# Altium project M2RB.PrjPcb (part 1 of 2)
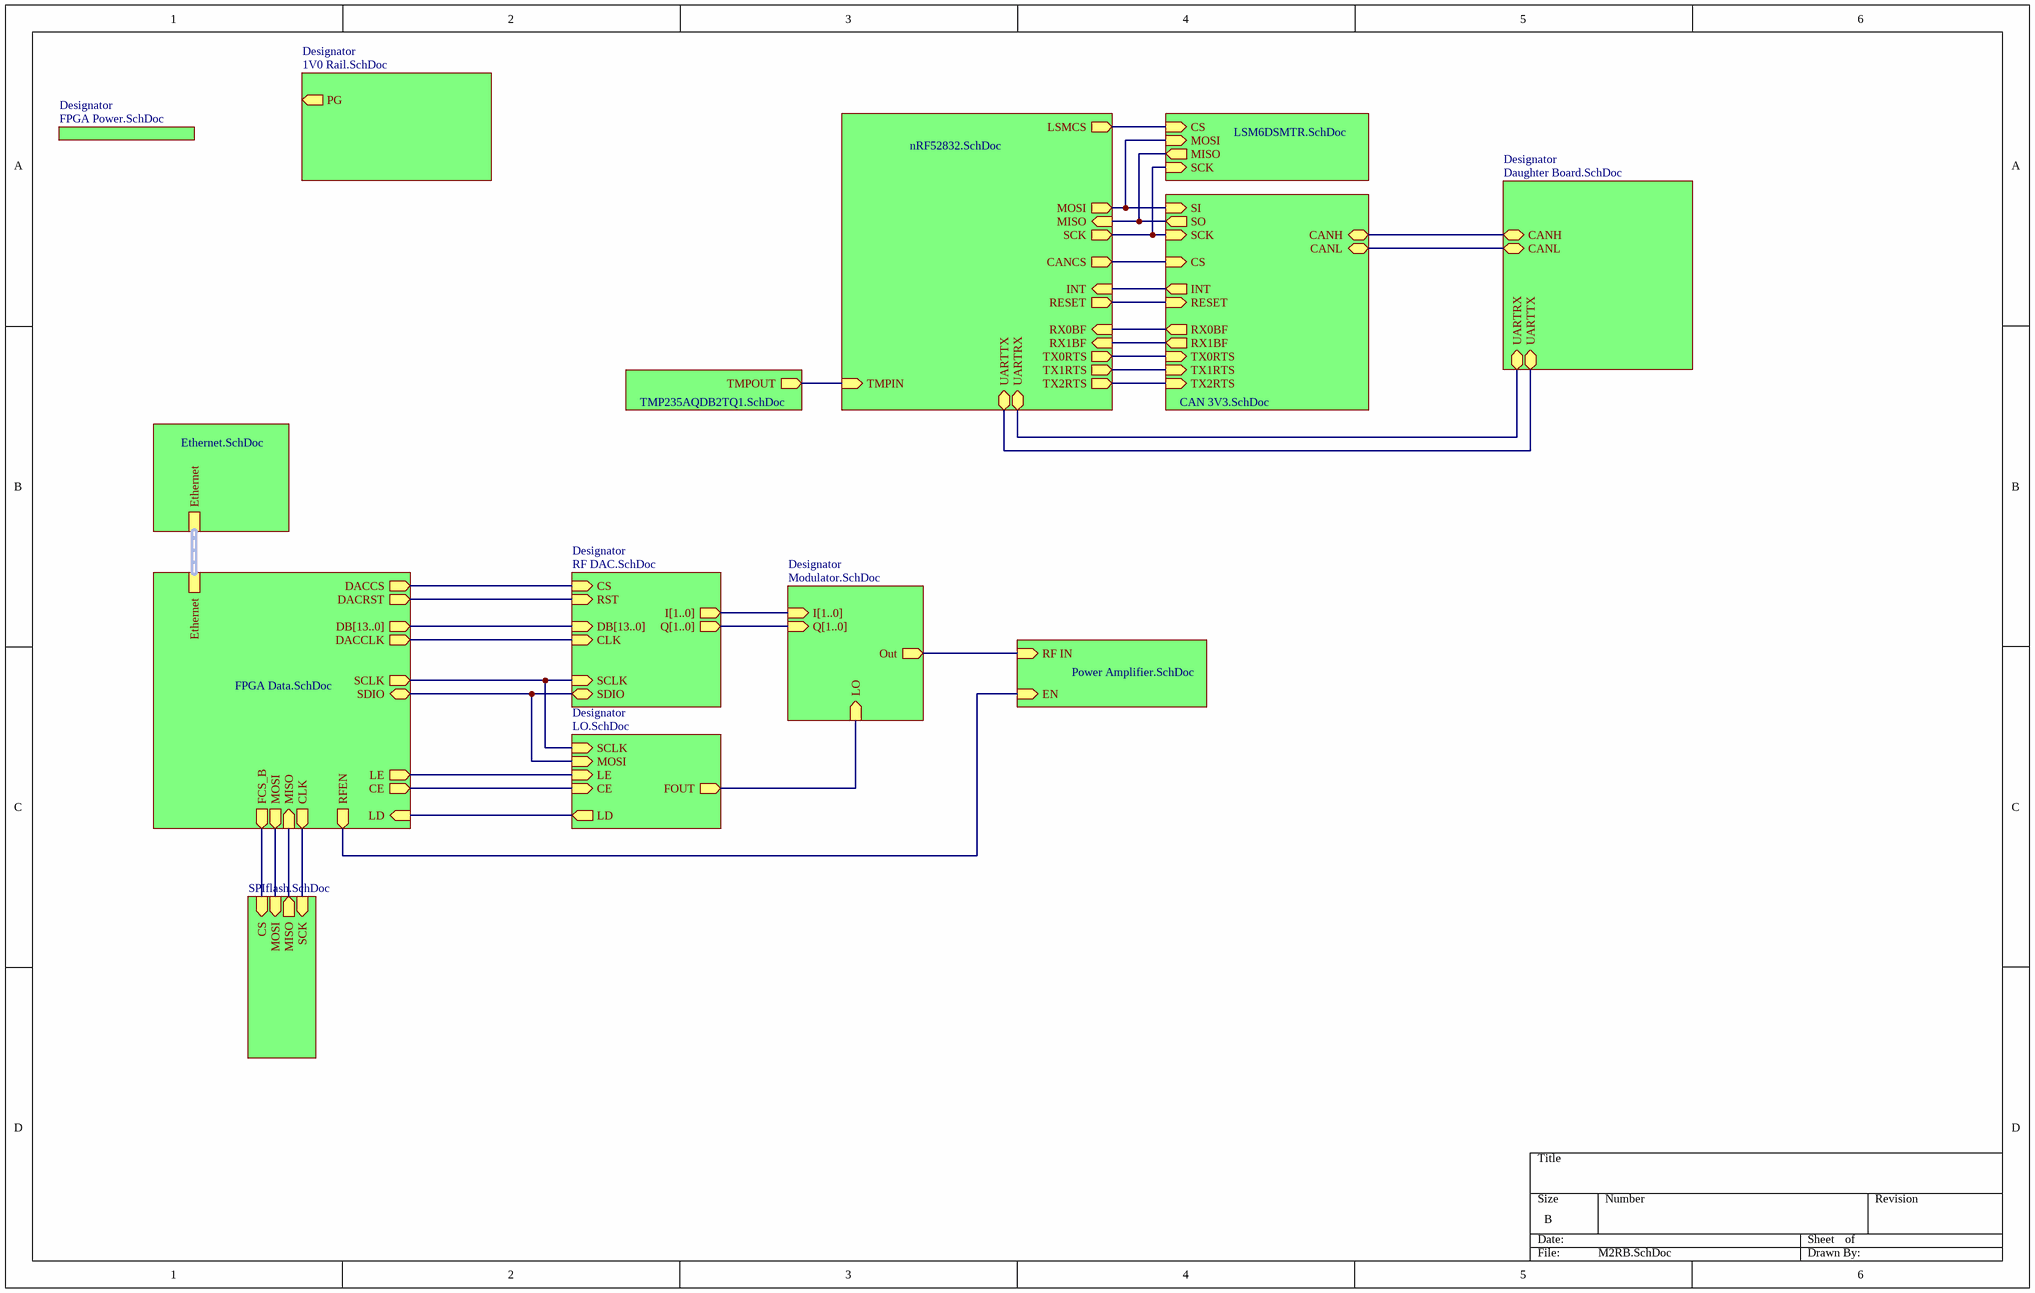
[diagram p0: M2RB.SchDoc]
15 sheets, 306 parts. Net scope: hierarchical (ports join the sheet entries above them; power ports are global).
Board file: M2RB.PcbDoc
Sheets:
  M2RB.SchDoc
    Designator = Power Amplifier.SchDoc
    Designator = Daughter Board.SchDoc
    Designator = nRF52832.SchDoc
    Designator = FPGA Power.SchDoc
    Designator = FPGA Data.SchDoc
    Designator = Ethernet.SchDoc
    Designator = 1V0 Rail.SchDoc
    Designator = SPIflash.SchDoc
    Designator = CAN 3V3.SchDoc
    Designator = LSM6DSMTR.SchDoc
    Designator = TMP235AQDB2TQ1.SchDoc
    Designator = Modulator.SchDoc
    Designator = RF DAC.SchDoc
    Designator = LO.SchDoc

## Sheet M2RB.SchDoc
size B

### Sub-sheets
Designator = Power Amplifier.SchDoc: RF IN (in), EN (in)
Designator = Daughter Board.SchDoc: UARTRX (bidir), UARTTX (bidir), CANL (bidir), CANH (bidir)
Designator = nRF52832.SchDoc: MOSI (out), MISO (in), TX0RTS (out), TX1RTS (out), RX1BF (in), SCK (out), RESET (out), RX0BF (in), TX2RTS (out), INT (in), CANCS (out), LSMCS (out), TMPIN (in), UARTRX (bidir), UARTTX (bidir)
Designator = FPGA Power.SchDoc: no entries
Designator = FPGA Data.SchDoc: CLK (out), MOSI (out), FCS_B (out), MISO (in), SCLK (out), SDIO (bidir), LE (out), CE (out), LD (in), DACCS (out), DACRST (out), DACCLK (out), DB[13..0] (out), RFEN (out), Ethernet (harness MII)
Designator = Ethernet.SchDoc: Ethernet (harness MII)
Designator = 1V0 Rail.SchDoc: PG (out)
Designator = SPIflash.SchDoc: CS (in), MOSI (in), MISO (out), SCK (in)
Designator = CAN 3V3.SchDoc: SI (in), RX0BF (out), INT (out), RX1BF (out), TX2RTS (in), TX1RTS (in), TX0RTS (in), SO (out), RESET (in), CS (in), SCK (in), CANL (bidir), CANH (bidir)
Designator = LSM6DSMTR.SchDoc: MISO (out), CS (in), SCK (in), MOSI (in)
Designator = TMP235AQDB2TQ1.SchDoc: TMPOUT (out)
Designator = Modulator.SchDoc: I[1..0] (in), LO (in), Out (out), Q[1..0] (in)
Designator = RF DAC.SchDoc: CS (in), RST (in), Q[1..0] (out), SDIO (bidir), SCLK (in), DB[13..0] (in), CLK (in), I[1..0] (out)
Designator = LO.SchDoc: LE (in), MOSI (in), LD (out), CE (in), SCLK (in), FOUT (out)

### Nets
EN: sheet Designator/EN, sheet Designator/RFEN
NetC1_1: sheet Designator/TMPIN, sheet Designator/TMPOUT
NetC5_2: sheet Designator/CANH, sheet Designator/CANH
NetC18#1_1: sheet Designator/RF IN, sheet Designator/Out
NetC85_2: sheet Designator/CANL, sheet Designator/CANL
NetCLK1_1: sheet Designator/SCLK, sheet Designator/SCLK, sheet Designator/SCLK
NetCLK2_1: sheet Designator/SDIO, sheet Designator/SDIO, sheet Designator/MOSI
NetCLK3_1: sheet Designator/DACCS, sheet Designator/CS
NetCLK4_1: sheet Designator/DACRST, sheet Designator/RST
NetCLK5_1: sheet Designator/LD, sheet Designator/LD
NetCLK6_1: sheet Designator/LE, sheet Designator/LE
NetCLK7_1: sheet Designator/CE, sheet Designator/CE
NetCLK_1: sheet Designator/DACCLK, sheet Designator/CLK
NetJ1_18: sheet Designator/UARTRX, sheet Designator/UARTRX
NetJ1_19: sheet Designator/UARTTX, sheet Designator/UARTTX
NetR27_1: sheet Designator/FCS_B, sheet Designator/CS
NetR75_2: sheet Designator/LO, sheet Designator/FOUT
NetU2_2: sheet Designator/MISO, sheet Designator/MISO
NetU2_5: sheet Designator/MOSI, sheet Designator/MOSI
NetU2_6: sheet Designator/CLK, sheet Designator/SCK
NetU5_4: sheet Designator/TX0RTS, sheet Designator/TX0RTS
NetU5_5: sheet Designator/TX1RTS, sheet Designator/TX1RTS
NetU5_6: sheet Designator/TX2RTS, sheet Designator/TX2RTS
NetU5_10: sheet Designator/RX1BF, sheet Designator/RX1BF
NetU5_11: sheet Designator/RX0BF, sheet Designator/RX0BF
NetU5_12: sheet Designator/INT, sheet Designator/INT
NetU5_13: sheet Designator/SCK, sheet Designator/SCK, sheet Designator/SCK
NetU5_14: sheet Designator/MOSI, sheet Designator/SI, sheet Designator/MOSI
NetU5_15: sheet Designator/MISO, sheet Designator/SO, sheet Designator/MISO
NetU5_16: sheet Designator/CANCS, sheet Designator/CS
NetU5_17: sheet Designator/RESET, sheet Designator/RESET
NetU9_5: sheet Designator/LSMCS, sheet Designator/CS

## Sheet Power Amplifier.SchDoc
size E
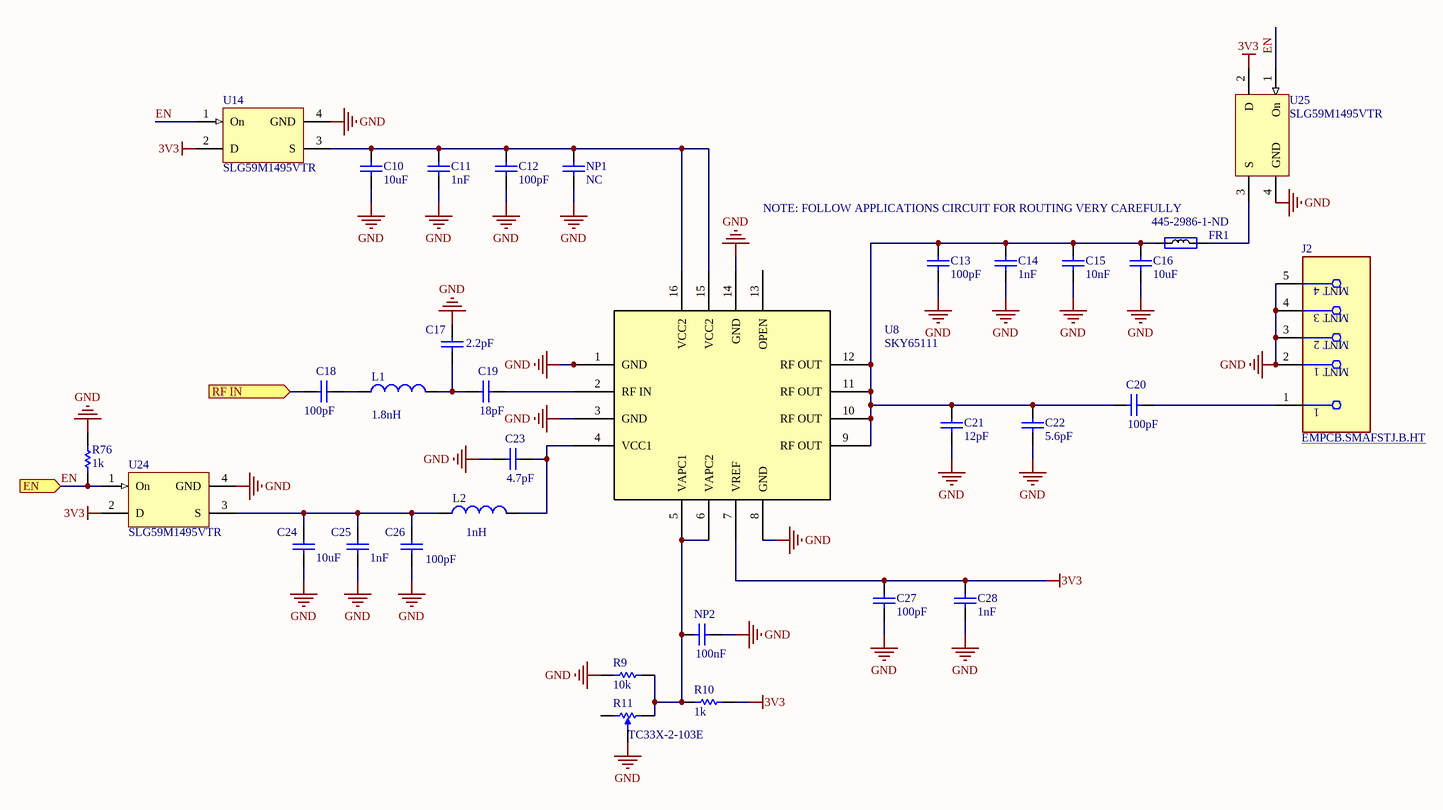
[diagram p1: Power Amplifier.SchDoc]

### Parts
(Parts that share a designator on the sheet are numbered #1, #2 ... from top to bottom, then left to right.)
C10  value 10uF  [C1206]  (hidden comment: Cap)
C11  value 1nF  [0402-A]  (hidden comment: Cap)
C12  value 100pF  [0402-A]  (hidden comment: Cap)
C13  value 100pF  [0402-A]  (hidden comment: Cap)
C14  value 1nF  [0402-A]  (hidden comment: Cap)
C15  value 10nF  [0402-A]  (hidden comment: Cap)
C16  value 10uF  [C1206]  (hidden comment: Cap)
C17#1  value 2.2pF  [0402-A]  (hidden comment: Cap)
C18#1  value 100pF  [0402-A]  (hidden comment: Cap)
C19#1  value 18pF  [0402-A]  (hidden comment: Cap)
C20#1  value 100pF  [0402-A]  (hidden comment: Cap)
C21#1  value 12pF  [0402-A]  (hidden comment: Cap)
C22#1  value 5.6pF  [0402-A]  (hidden comment: Cap)
C23#1  value 4.7pF  [0402-A]  (hidden comment: Cap)
C24#1  value 10uF  [C1206]  (hidden comment: Cap)
C25#1  value 1nF  [0402-A]  (hidden comment: Cap)
C26#1  value 100pF  [0402-A]  (hidden comment: Cap)
C27#1  value 100pF  [0402-A]  (hidden comment: Cap)
C28#1  value 1nF  [0402-A]  (hidden comment: Cap)
FR1  Supplier Part Number 1: 445-2986-1-ND  [1608[0603]]  (hidden comment: 200R, 1.8A)
J2  EMPCB.SMAFSTJ.B.HT  [FP-EMPCB_SMAFSTJ_B_HT-MFG]
L1  value 1.8nH  [0402-A]  (hidden comment: Inductor)
L2  value 1nH  [0402-A]  (hidden comment: Inductor)
NP1  value NC  [0402-A]  (hidden comment: Cap)
NP2  value 100nF  [0402-A]  (hidden comment: Cap)
R9  value 10k  [0402-A]  (hidden comment: Res1)
R10  value 1k  [0402-A]  (hidden comment: Res1)
R11#1  TC33X-2-103E  [BOUR-TC33X-2_V]
R76  value 1k  [0402-A]  (hidden comment: Res1)
U8  SKY65111  [SKY65111]
U14#1  SLG59M1495VTR  [SLG59M1495VTR]
U24  SLG59M1495VTR  [SLG59M1495VTR]
U25  SLG59M1495VTR  [SLG59M1495VTR]

### Ports
EN (in), RF IN (in)

### Nets
3V3: C27#1.2 C28#1.2 R10.2 U8.7(VREF) U14#1.2(D) U24.2(D) U25.2(D)
GND: C10.1 C11.1 C12.1 C13.1 C14.1 C15.1 C16.1 C17#1.1 C21#1.1 C22#1.1 C23#1.1 C24#1.1 C25#1.1 C26#1.1 C27#1.1 C28#1.1 J2.2(MNT_1) J2.3(MNT_2) J2.4(MNT_3) J2.5(MNT_4) NP1.1 NP2.2 R9.1 R11#1.2 R76.2 U8.1(GND) U8.3(GND) U8.8(GND) U8.14(GND) U8.17(GND) U14#1.4(GND) U24.4(GND) U25.4(GND)
EN: R76.1 U14#1.1(On) U24.1(On) U25.1(On) ; port EN
NetC10_2: C10.2 C11.2 C12.2 NP1.2 U8.15(VCC2) U8.16(VCC2) U14#1.3(S)
NetC13_2: C13.2 C14.2 C15.2 C16.2 C20#1.1 C21#1.2 C22#1.2 FR1.1 U8.9(RF_OUT) U8.10(RF_OUT) U8.11(RF_OUT) U8.12(RF_OUT)
NetC17#1_2: C17#1.2 C19#1.1 L1.2
NetC18#1_1: C18#1.1 ; port RF IN
NetC18#1_2: C18#1.2 L1.1
NetC19#1_2: C19#1.2 U8.2(RF_IN)
NetC20#1_2: C20#1.2 J2.1
NetC23#1_2: C23#1.2 L2.2 U8.4(VCC1)
NetC24#1_2: C24#1.2 C25#1.2 C26#1.2 L2.1 U24.3(S)
NetFR1_2: FR1.2 U25.3(S)
NetNP2_1: NP2.1 R9.2 R10.1 R11#1.3 U8.5(VAPC1) U8.6(VAPC2)

Not connected (* = marked no-connect by the designer): R11#1 1; U8 13(OPEN)

### Notes on the sheet
- NOTE: FOLLOW APPLICATIONS CIRCUIT FOR ROUTING VERY CAREFULLY

### Library data of the parts
C10-C16 C17#1 C18#1 C19#1 C20#1 C21#1 C22#1 C23#1 C24#1 C25#1 C26#1 C27#1 C28#1 NP1 NP2 = Cap: Capacitor; Published: 8-Jun-2000; LatestRevisionDate: 17-Jul-2002; LatestRevisionNote: Re-released for DXP Platform.; PackageReference: RAD-0.3; Publisher: Altium Limited; PackageDescription: Radial Cap, Thru-Hole; 2 Leads; 0.3 in Pin Spacing
FR1 = Ferrite: Manufacturer Part Number 1: BK0603TS601-T; Manufacturer: Taiyo Yuden; Part Description: FERRITE BEAD 600 OHM 0201 1LN; DC Resistance (DCR): 750 mOhm Max; Filter Type: Differential Mode - Single; Impedance @ Frequency: 600 Ohm @ 100MHz; Current Rating: 270mA; Value: 600R@100MHz; Size / Dimension: 0.024" L x 0.012" W (0.60mm x 0.30mm); Package / Case: 0201 (0603 Metric); Height (Max): 0.013" (0.33mm); Mounting Type: Surface Mount; Packaging: Cut Tape (CT); RoHS: RoHS Compliant; Category: Filters; Supplier 1: Digi-Key
J2 = CMP-111093-000001-1: CONN SMA JACK STR 50OHM EDGE MNT; Manufacturer: Taoglas Limited; Conn Orientation: Horizontal; Frequency: 12.4GHz; Impedance: 50Ω; Voltage Rating: 335V; Is Female: yes; Pitch: 2.62mm; Number Of Contacts: 1; Device Class L2: RF / Coaxial Connectors; Category: Conn; Contact Material: Gold; Device Class L1: Connectors; Digikey Description: CONN SMA JACK STR 50OHM EDGE MNT; Temperature Range Low: -40°C; Octopart: https://octopart.com/empcb.smafstj.b.ht-taoglas-24204431; ComponentLink2URL: https://cdn.taoglas.com/datasheets/EMPCB.SMAFSTJ.B.HT.pdf; Temperature Range High: +85°C; Device Class L3: unset; Temperature: -40°C to +85°C; Package: 0; RoHS: TRUE; Lead Free: Yes; Automotive: No; ComponentLink2Description: Datasheet; Mouser Description: RF Connectors / Coaxial Connectors SMA Straight Edge Mount PCB Jack-Gold; Manufacturer Part Number: EMPCB.SMAFSTJ.B.HT
L1 L2 = Inductor: Code_IEC: 1005; Published: 8-Jun-2000; LatestRevisionDate: 29-May-2009; LatestRevisionNote: IPC-7351 Footprint Added.; PackageReference: 0402-A; Publisher: Altium Limited; PackageDescription: Chip Inductor; Code_JEITA: 0402
R9 R10 R76 = Res1: Resistor; Published: 8-Jun-2000; LatestRevisionDate: 17-Jul-2002; LatestRevisionNote: Re-released for DXP Platform.; PackageReference: AXIAL-0.3; Publisher: Altium Limited; PackageDescription: Axial Device, Thru-Hole; 2 Leads; 0.3 in Pin Spacing
R11#1 = CMP-2100-03695-1: Trimming Potentiometer, 10000 Ohm, -40 to 100 degC, 3-Pin SMD, RoHS, Tape and Reel; Manufacturer: Bourns; Tolerance: 25%; Max Power Dissipation: 100mW; Number of Turns: 1; Resistance: 10KOhm; Temperature Coefficient: 250ppm/degreesC; Voltage Rating (DC): 50V; Datasheet URL: http://www.bourns.com/docs/Product-Datasheets/TC33.pdf; Composition: Potentiometer; Package Description: 3-Pin Surface Mount Device, Body 3.8 x 3.6 mm; Weight: 29.4mg; Power Rating: 100mW; Termination: FootPrint; Manufacturer URL: http://www.bourns.com/; Width: 0.118inch; Height: 0.047inch; Military Standard: Not; Radiation Hardening: No; Colour: Silver; Case/Package: SMD/SMT; Depth: 3.8mm; Min Operating Temperature: -40degC; Lead Free: LeadFree; Datasheet Version: 42583.0; REACH SVHC: NoSVHC; Length: 3mm; RoHSCompliant: true; Contact Plating: Silver; Taper: Linear; Packaging: TapeandReel; Mount: SurfaceMount; Max Operating Temperature: 100degC; Package Reference: TC33X-2; Package Quantity: 2500

## Sheet Daughter Board.SchDoc
size A
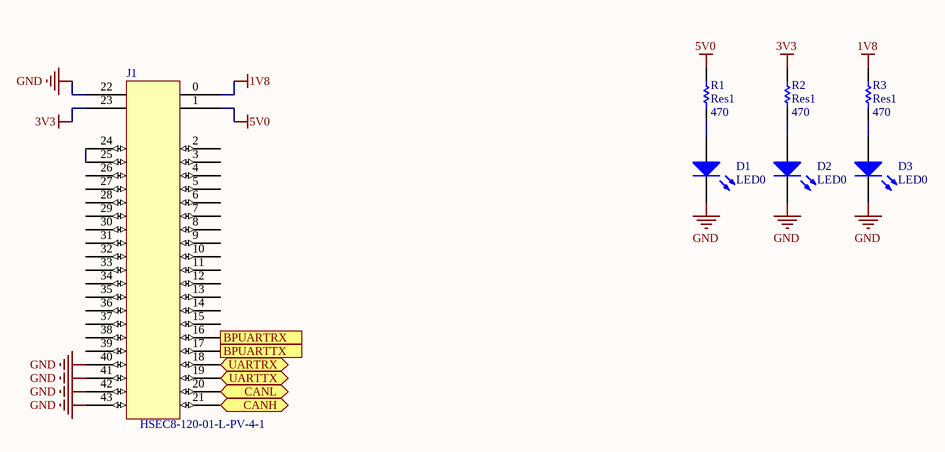
[diagram p2: Daughter Board.SchDoc]

### Parts
D1  LED0  [1608[0603]]
D2  LED0  [1608[0603]]
D3  LED0  [1608[0603]]
J1  HSEC8-120-01-L-PV-4-1  [HSEC8-120-01-L-PV-4-1 Gold Fingers]
R1  Res1  value 470  [1608[0603]]
R2  Res1  value 470  [1608[0603]]
R3  Res1  value 470  [1608[0603]]

### Ports
BPUARTRX (out), BPUARTTX (in), CANH (bidir), CANL (bidir), UARTRX (bidir), UARTTX (bidir)

### Nets
1V8: J1.0 R3.2
3V3: J1.23 R2.2
5V0: J1.1 R1.2
GND: D1.2(K) D2.2(K) D3.2(K) J1.22 J1.40 J1.41 J1.42 J1.43
NetC5_2: J1.21 ; port CANH
NetC85_2: J1.20 ; port CANL
NetD1_1: D1.1(A) R1.1
NetD2_1: D2.1(A) R2.1
NetD3_1: D3.1(A) R3.1
NetJ1_16: J1.16 ; port BPUARTRX
NetJ1_17: J1.17 ; port BPUARTTX
NetJ1_18: J1.18 ; port UARTRX
NetJ1_19: J1.19 ; port UARTTX
NetJ1_24: J1.24 J1.25

Not connected (* = marked no-connect by the designer): J1 2(0) 3(0) 4(0) 5(0) 6(0) 7(0) 8(0) 9(0) 10(0) 11(0) 12(0) 13(0) 14(0) 15(0) 26 27 28 29 30 31 32 33 34 35 36 37 38 39

### Library data of the parts
R1-R3 = Res1: Resistor; Published: 8-Jun-2000; LatestRevisionDate: 17-Jul-2002; LatestRevisionNote: Re-released for DXP Platform.; PackageReference: AXIAL-0.3; Publisher: Altium Limited; PackageDescription: Axial Device, Thru-Hole; 2 Leads; 0.3 in Pin Spacing
D1-D3 = LED0: Published: 8-Jun-2000; LatestRevisionDate: 08-Jul-2005; LatestRevisionNote: Mech Layer 1 removed.; PackageReference: LED-0; Publisher: Altium Limited; PackageDescription: LED; 2 Leads
J1 = HSEC8-120-01-L-PV-4-1: Supplier 1: Mouser

## Sheet nRF52832.SchDoc
size A
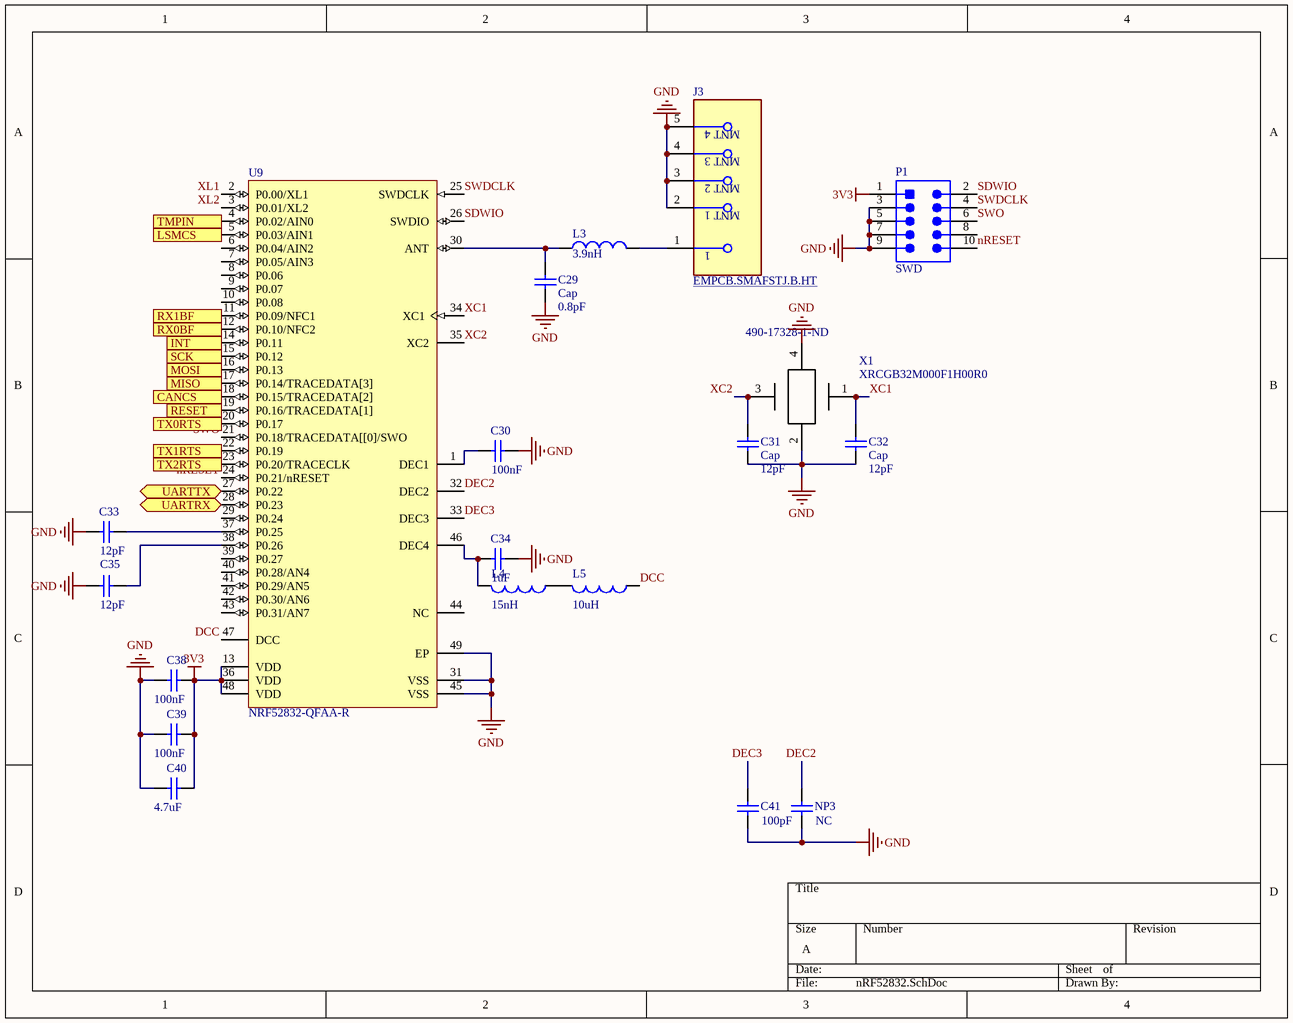
[diagram p3: nRF52832.SchDoc]

### Parts
C29  Cap  value 0.8pF  [0402-A]
C30  value 100nF  [0402-A]  (hidden comment: Cap)
C31  Cap  value 12pF  [0402-A]
C32  Cap  value 12pF  [0402-A]
C33  value 12pF  [0402-A]  (hidden comment: Cap)
C34  value 1uF  [1608[0603]]  (hidden comment: Cap)
C35  value 12pF  [0402-A]  (hidden comment: Cap)
C38  value 100nF  [0402-A]  (hidden comment: Cap)
C39  value 100nF  [0402-A]  (hidden comment: Cap)
C40  value 4.7uF  [6-0805_M]  (hidden comment: Cap)
C41  value 100pF  [0402-A]  (hidden comment: Cap)
J3  EMPCB.SMAFSTJ.B.HT  [FP-EMPCB_SMAFSTJ_B_HT-MFG]
L3  value 3.9nH  [0402-A]  (hidden comment: Inductor)
L4  value 15nH  [0402-A]  (hidden comment: Inductor)
L5  value 10uH  [1608[0603]]  (hidden comment: Inductor)
NP3  value NC  [0402-A]  (hidden comment: Cap)
P1  SWD  [SMTC-FTSH-105-01-L-DV-K_V]
U9  NRF52832-QFAA-R  [NRSC-QF-48_M]
X1  XRCGB32M000F1H00R0  Supplier Part Number 1: 490-17328-1-ND  [XRCGB32M000F1H00R0]

### Ports
CANCS (out), INT (in), LSMCS (out), MISO (in), MOSI (out), RESET (out), RX0BF (in), RX1BF (in), SCK (out), TMPIN (in), TX0RTS (out), TX1RTS (out), TX2RTS (out), UARTRX (bidir), UARTTX (bidir)

### Nets
3V3: C38.1 C39.1 C40.1 P1.1 U9.13(VDD) U9.36(VDD) U9.48(VDD)
GND: C29.1 C30.1 C31.1 C32.1 C33.2 C34.1 C35.2 C38.2 C39.2 C40.2 C41.1 J3.2(MNT_1) J3.3(MNT_2) J3.4(MNT_3) J3.5(MNT_4) NP3.1 P1.3 P1.5 P1.7 P1.9 U9.31(VSS) U9.45(VSS) U9.49(EP) X1.2 X1.4
DCC: L5.1 U9.47(DCC)
DEC2: NP3.2 U9.32(DEC2)
DEC3: C41.2 U9.33(DEC3)
nRESET: P1.10 U9.24(P0.21/nRESET)
SDWIO: P1.2 U9.26(SWDIO)
SWDCLK: P1.4 U9.25(SWDCLK)
SWO: P1.6 U9.21(P0.18/TRACEDATA[[0]/SWO)
XC1: C32.2 U9.34(XC1) X1.1
XC2: C31.2 U9.35(XC2) X1.3
XL1: U9.2(P0.00/XL1)
XL2: U9.3(P0.01/XL2)
NetC1_1: U9.4(P0.02/AIN0) ; port TMPIN
NetC29_2: C29.2 L3.1 U9.30(ANT)
NetC30_2: C30.2 U9.1(DEC1)
NetC33_1: C33.1 U9.37(P0.25)
NetC34_2: C34.2 L4.2 U9.46(DEC4)
NetC35_1: C35.1 U9.38(P0.26)
NetJ1_18: U9.28(P0.23) ; port UARTRX
NetJ1_19: U9.27(P0.22) ; port UARTTX
NetJ3_1: J3.1 L3.2
NetL4_1: L4.1 L5.2
NetU5_4: U9.20(P0.17) ; port TX0RTS
NetU5_5: U9.22(P0.19) ; port TX1RTS
NetU5_6: U9.23(P0.20/TRACECLK) ; port TX2RTS
NetU5_10: U9.11(P0.09/NFC1) ; port RX1BF
NetU5_11: U9.12(P0.10/NFC2) ; port RX0BF
NetU5_12: U9.14(P0.11) ; port INT
NetU5_13: U9.15(P0.12) ; port SCK
NetU5_14: U9.16(P0.13) ; port MOSI
NetU5_15: U9.17(P0.14/TRACEDATA[3]) ; port MISO
NetU5_16: U9.18(P0.15/TRACEDATA[2]) ; port CANCS
NetU5_17: U9.19(P0.16/TRACEDATA[1]) ; port RESET
NetU9_5: U9.5(P0.03/AIN1) ; port LSMCS

Not connected (* = marked no-connect by the designer): P1 8; U9 6(P0.04/AIN2) 7(P0.05/AIN3) 8(P0.06) 9(P0.07) 10(P0.08) 29(P0.24) 39(P0.27) 40(P0.28/AN4) 41(P0.29/AN5) 42(P0.30/AN6) 43(P0.31/AN7) 44(NC)

### Library data of the parts
C29-C35 C38-C41 NP3 = Cap: Capacitor; Published: 8-Jun-2000; LatestRevisionDate: 17-Jul-2002; LatestRevisionNote: Re-released for DXP Platform.; PackageReference: RAD-0.3; Publisher: Altium Limited; PackageDescription: Radial Cap, Thru-Hole; 2 Leads; 0.3 in Pin Spacing
J3 = CMP-111093-000001-1: as J2 on sheet Power Amplifier; Device Class L2: RF / Coaxial Connectors; Category: Conn; Contact Material: Gold; Device Class L1: Connectors; Digikey Description: CONN SMA JACK STR 50OHM EDGE MNT; Temperature Range Low: -40°C; Octopart: https://octopart.com/empcb.smafstj.b.ht-taoglas-24204431; ComponentLink2URL: https://cdn.taoglas.com/datasheets/EMPCB.SMAFSTJ.B.HT.pdf; Temperature Range High: +85°C; Device Class L3: unset; Temperature: -40°C to +85°C; Package: 0; RoHS: TRUE; Lead Free: Yes; Automotive: No; ComponentLink2Description: Datasheet; Mouser Description: RF Connectors / Coaxial Connectors SMA Straight Edge Mount PCB Jack-Gold; Manufacturer Part Number: EMPCB.SMAFSTJ.B.HT
L3-L5 = Inductor: Code_IEC: 1005; Published: 8-Jun-2000; LatestRevisionDate: 29-May-2009; LatestRevisionNote: IPC-7351 Footprint Added.; PackageReference: 0402-A; Publisher: Altium Limited; PackageDescription: Chip Inductor; Code_JEITA: 0402
P1 = CMP-2000-05353-1: Male Header, Pitch 1.27 mm, 2 x 5 Position, Height 6.25 mm; Manufacturer: Samtec; Pitch: 0.050"(1.27mm); Other Names: Q3937619; Number of Positions: 10; Mating Products: SFMC-105-L2-S-D-TR-ND / -CONN.05"SURFACE10POSSMT / FLE-105-01-G-DV-TR-ND / -CONNSKT1.27MM10POSDUALSMD / FLE-105-01-G-DV-A-P-ND / -CONNSKT1.27MM10POSDUALSMD / FLE-105-01-G-DV-A-ND / -CONNSKT1.27MM10POSDUALSMD / CLP-105-02-G-D-P-TR-ND / -CONNRCPT10POSDUAL.05"SMD / SAM1155-05-ND / -CONNRCPT10POSDUAL.05"SMD / SAM1154-05-ND / -CONNRCPT10POSDUAL.05"SMD / SAM1153-05-ND / -CONNRCPT10POSDUAL.05"SMD / SAM1226-05-ND / -CONNRCPT.05"10POSDUALSMD; Number of Positions Loaded: All; Connector Type: Header,Unshrouded; Product Training Modules: Board-to-BoardConnectors; Datasheet Version: Rev. ET, 10/1995; Number of Rows: 2; Standard Package: 1; Package Description: Male Header, Pitch 1.27 mm, 2 x 5 Position, Height 5.97 mm, Tail Length 4.32 mm; Contact Finish Thickness: 10µin(0.25µm); Series: FTSH; Termination: Solder; Contact Type: MalePin; Color: Black; Package Reference: FTSH-105-01-L-DV-K; Family: RectangularConnectors-Headers,MalePins; Package URL: http://suddendocs.samtec.com/prints/ftsh-1xx-xx-xxx-dv-xxx-footprint.pdf; Packaging: Tube; Mounting Type: SurfaceMount; Category: Connectors,Interconnects; Datasheet URL: http://suddendocs.samtec.com/prints/ftsh-1xx-xx-xxx-dv-xxx-mkt.pdf; Row Spacing: 0.050"(1.27mm); Manufacturer URL: http://www.samtec.com/; Contact Mating Length: 0.120"(3.05mm); Contact Finish: Gold
U9 = CMP-2100-03661-1: Multiprotocol Bluetooth Smart, ANT/ANT+ and Proprietary System-on-Chip, 2.4 GHz, 256 KB FLASH, 1.7 to 3.6 V, -40 to 85 degC, 48-Pin QFN, RoHS, Tape and Reel; Manufacturer: Nordic Semiconductor; Frequency: 2.4GHz; Datasheet Version: Rev. 1.0, 02/2016; Datasheet URL: http://infocenter.nordicsemi.com/pdf/nRF52832_PS_v1.0.pdf; Mount: SurfaceMount; Max Operating Temperature: 85degC; Manufacturer URL: http://www.nordicsemi.com/eng/Products/; Lead Free: LeadFree; Min Operating Temperature: -40degC; RoHSCompliant: true; Package Reference: QF-48; Package Description: 48-Pin Quad Flat No-lead Package, Body 6 x 6 mm, Pitch 0.4 mm, Thermal Pad 4.6 x 4.6 mm; Max Frequency: 2.4GHz; Packaging: TapeandReel
X1 = XRCGB32M000F1H00R0: 32MHz Crystal Oscillator; Supplier 1: Digi-Key

## Sheet FPGA Power.SchDoc
size E
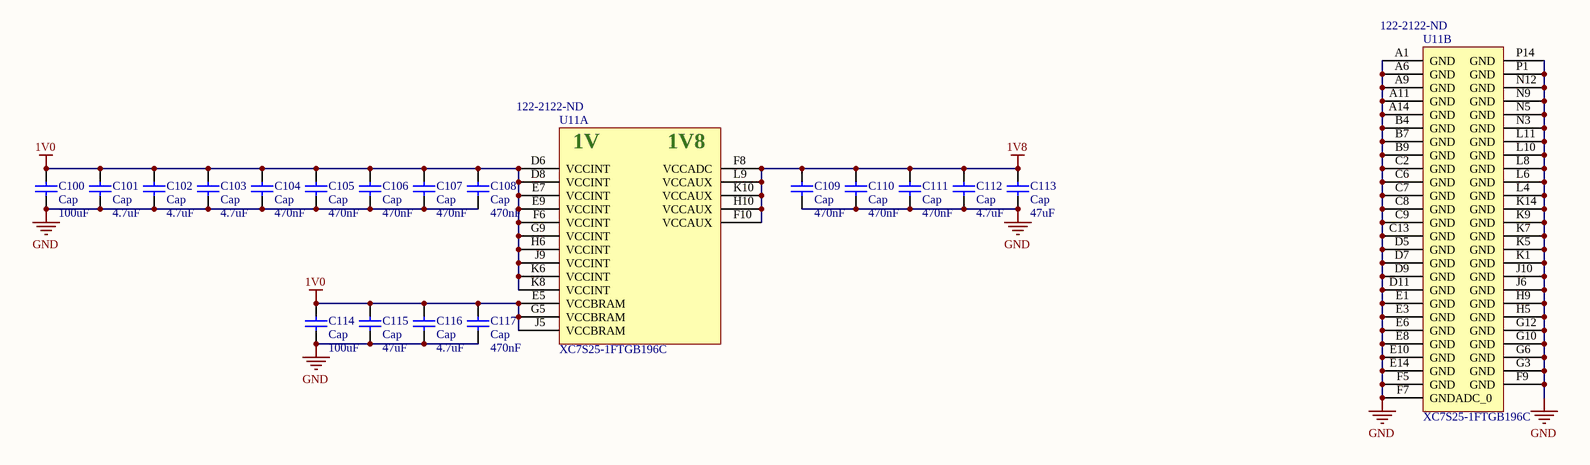
[diagram p4: FPGA Power.SchDoc]

### Parts
C100  Cap  value 100uF  [C1210]
C101  Cap  value 4.7uF  [6-0805_M]
C102  Cap  value 4.7uF  [6-0805_M]
C103  Cap  value 4.7uF  [6-0805_M]
C104  Cap  value 470nF  [1608[0603]]
C105  Cap  value 470nF  [1608[0603]]
C106  Cap  value 470nF  [1608[0603]]
C107  Cap  value 470nF  [1608[0603]]
C108  Cap  value 470nF  [1608[0603]]
C109  Cap  value 470nF  [1608[0603]]
C110  Cap  value 470nF  [1608[0603]]
C111  Cap  value 470nF  [1608[0603]]
C112  Cap  value 4.7uF  [6-0805_M]
C113  Cap  value 47uF  [C1210]
C114  Cap  value 100uF  [C1210]
C115  Cap  value 47uF  [C1210]
C116  Cap  value 4.7uF  [6-0805_M]
C117  Cap  value 470nF  [1608[0603]]
U11  XC7S25-1FTGB196C  Supplier Part Number 1: 122-2122-ND  [FTGB196 Package]  (parts A,B of 5)

### Nets
1V0: C100.2 C101.2 C102.2 C103.2 C104.2 C105.2 C106.2 C107.2 C108.2 C114.2 C115.2 C116.2 C117.2 U11.D6(VCCINT) U11.D8(VCCINT) U11.E5(VCCBRAM) U11.E7(VCCINT) U11.E9(VCCINT) U11.F6(VCCINT) U11.G5(VCCBRAM) U11.G9(VCCINT) U11.H6(VCCINT) U11.J5(VCCBRAM) U11.J9(VCCINT) U11.K6(VCCINT) U11.K8(VCCINT)
1V8: C109.2 C110.2 C111.2 C112.2 C113.2 U11.F8(VCCADC) U11.F10(VCCAUX) U11.H10(VCCAUX) U11.K10(VCCAUX) U11.L9(VCCAUX)
GND: C100.1 C101.1 C102.1 C103.1 C104.1 C105.1 C106.1 C107.1 C108.1 C109.1 C110.1 C111.1 C112.1 C113.1 C114.1 C115.1 C116.1 C117.1 U11.A1(GND) U11.A6(GND) U11.A9(GND) U11.A11(GND) U11.A14(GND) U11.B4(GND) U11.B7(GND) U11.B9(GND) U11.C2(GND) U11.C6(GND) U11.C7(GND) U11.C8(GND) U11.C9(GND) U11.C13(GND) U11.D5(GND) U11.D7(GND) U11.D9(GND) U11.D11(GND) U11.E1(GND) U11.E3(GND) U11.E6(GND) U11.E8(GND) U11.E10(GND) U11.E14(GND) U11.F5(GND) U11.F7(GNDADC_0) U11.F9(GND) U11.G3(GND) U11.G6(GND) U11.G10(GND) U11.G12(GND) U11.H5(GND) U11.H9(GND) U11.J6(GND) U11.J10(GND) U11.K1(GND) U11.K5(GND) U11.K7(GND) U11.K9(GND) U11.K14(GND) U11.L4(GND) U11.L6(GND) U11.L8(GND) U11.L10(GND) U11.L11(GND) U11.N3(GND) U11.N5(GND) U11.N9(GND) U11.N12(GND) U11.P1(GND) U11.P14(GND)

### Notes on the sheet
- (in symbol XC7S25-1FTGB196C, part A) 1V; 1V8

### Library data of the parts
C100-C117 = Cap: Capacitor; Published: 8-Jun-2000; LatestRevisionDate: 17-Jul-2002; LatestRevisionNote: Re-released for DXP Platform.; PackageReference: RAD-0.3; Publisher: Altium Limited; PackageDescription: Radial Cap, Thru-Hole; 2 Leads; 0.3 in Pin Spacing
  C100 C114: ComponentLink1Description: New link; ComponentLink1URL: *; Supplier 1: Digi-Key; Supplier Part Number 1: 490-9969-1-ND
  C101-C103 C112 C116: Supplier 1: Digi-Key; Supplier Part Number 1: 490-14466-1-ND
  C113 C115: Supplier 1: Digi-Key; Supplier Part Number 1: 490-4844-1-ND
U11 = XC7S25-1FTGB196C: Supplier 1: Digi-Key

## Sheet FPGA Data.SchDoc
size E
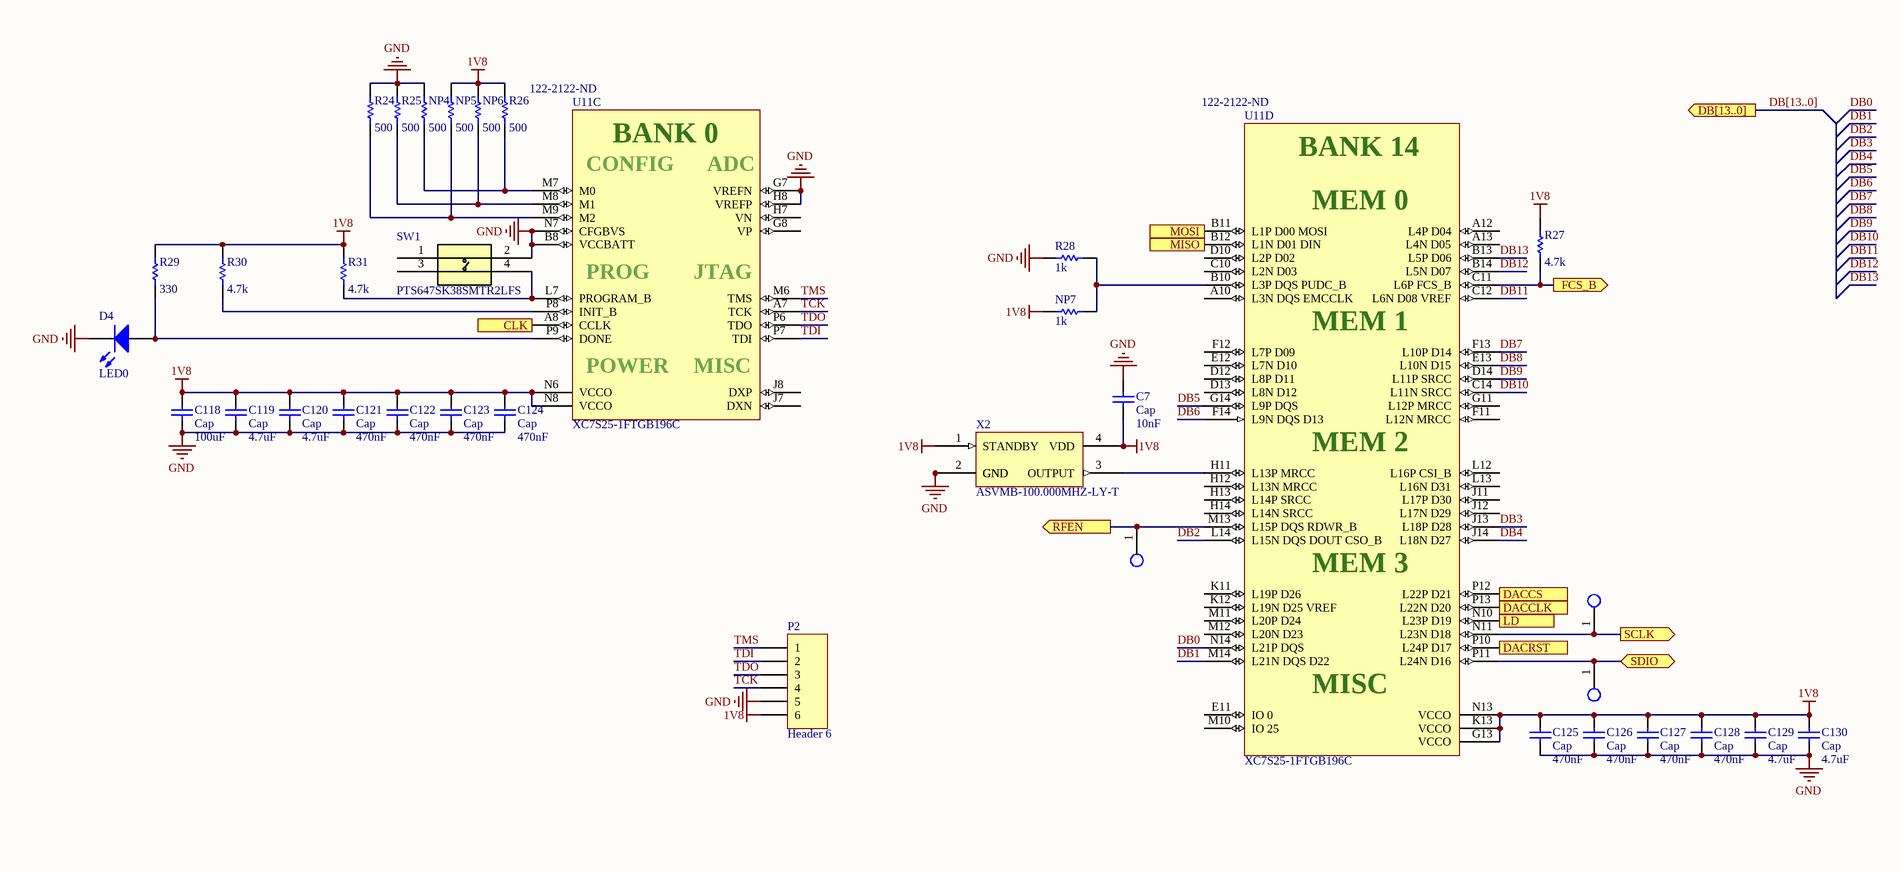
[diagram p5: FPGA Data.SchDoc, left]
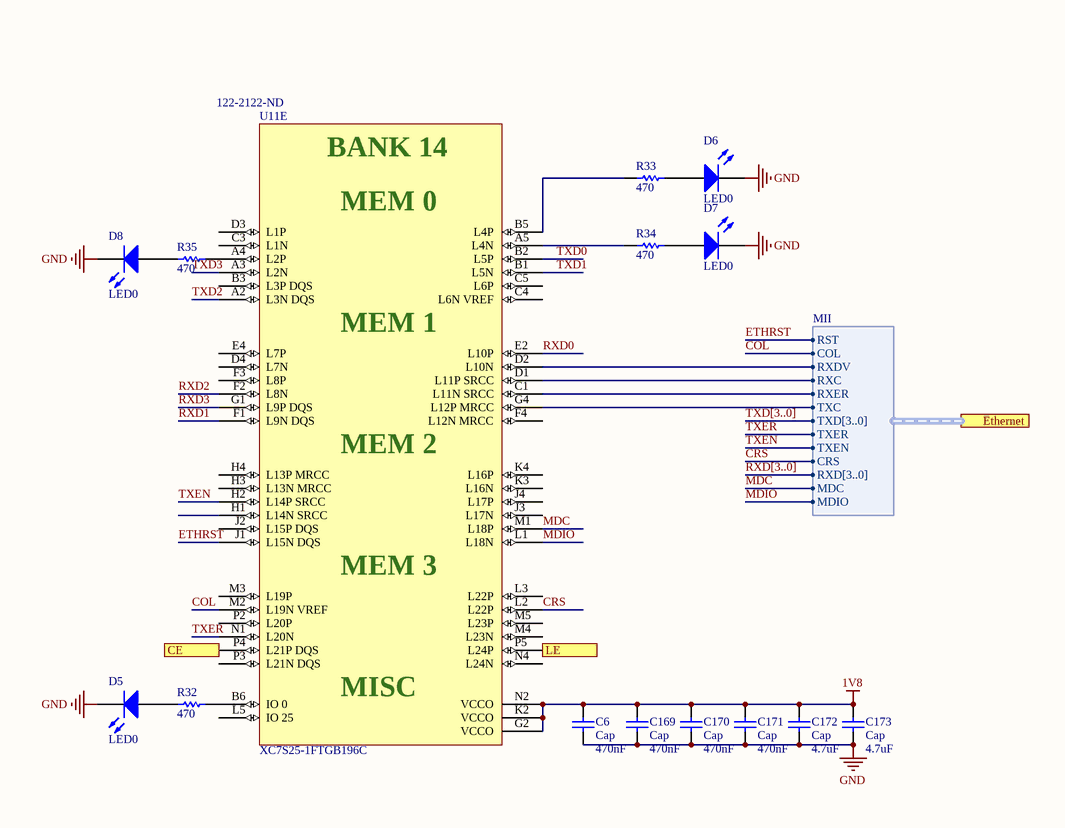
[diagram p6: FPGA Data.SchDoc, right]

### Parts
C6  Cap  value 470nF  [1608[0603]]
C7  Cap  value 10nF  [0402-A]
C118  Cap  value 100uF  [C1210]
C119  Cap  value 4.7uF  [6-0805_M]
C120  Cap  value 4.7uF  [6-0805_M]
C121  Cap  value 470nF  [1608[0603]]
C122  Cap  value 470nF  [1608[0603]]
C123  Cap  value 470nF  [1608[0603]]
C124  Cap  value 470nF  [1608[0603]]
C125  Cap  value 470nF  [1608[0603]]
C126  Cap  value 470nF  [1608[0603]]
C127  Cap  value 470nF  [1608[0603]]
C128  Cap  value 470nF  [1608[0603]]
C129  Cap  value 4.7uF  [6-0805_M]
C130  Cap  value 4.7uF  [6-0805_M]
C169  Cap  value 470nF  [1608[0603]]
C170  Cap  value 470nF  [1608[0603]]
C171  Cap  value 470nF  [1608[0603]]
C172  Cap  value 4.7uF  [6-0805_M]
C173  Cap  value 4.7uF  [6-0805_M]
CLK1  5029  [EXPOSED PAD 0.02X0.02]  (value not drawn)
CLK2  5029  [EXPOSED PAD 0.02X0.02]  (value not drawn)
CLK8  5029  [EXPOSED PAD 0.02X0.02]  (value not drawn)
D4  LED0  [1608[0603]]
D5  LED0  [1608[0603]]
D6  LED0  [1608[0603]]
D7  LED0  [1608[0603]]
D8  LED0  [1608[0603]]
NP4  value 500  [0402-A]  (hidden comment: Res1)
NP5  value 500  [0402-A]  (hidden comment: Res1)
NP6  value 500  [0402-A]  (hidden comment: Res1)
NP7  value 1k  [0402-A]  (hidden comment: Res1)
P2  Header 6  [HDR1X6]
R24  value 500  [0402-A]  (hidden comment: Res1)
R25  value 500  [0402-A]  (hidden comment: Res1)
R26  value 500  [0402-A]  (hidden comment: Res1)
R27  value 4.7k  [0402-A]  (hidden comment: Res1)
R28  value 1k  [0402-A]  (hidden comment: Res1)
R29  value 330  [0402-A]  (hidden comment: Res1)
R30  value 4.7k  [0402-A]  (hidden comment: Res1)
R31  value 4.7k  [0402-A]  (hidden comment: Res1)
R32  value 470  [0402-A]  (hidden comment: Res1)
R33  value 470  [0402-A]  (hidden comment: Res1)
R34  value 470  [0402-A]  (hidden comment: Res1)
R35  value 470  [0402-A]  (hidden comment: Res1)
SW1  PTS647SK38SMTR2LFS  [PTS647SK38SMTR2LFS_CNK]
U11  XC7S25-1FTGB196C  Supplier Part Number 1: 122-2122-ND  [FTGB196 Package]  (parts C,D,E of 5)
X2  ASVMB-100.000MHZ-LY-T  [ASVMB-100.000MHZ-LY-T]

### Ports
CE (out), CLK (out), DACCLK (out), DACCS (out), DACRST (out), DB[13..0] (out), Ethernet (harness MII), FCS_B (out), LD (in), LE (out), MISO (in), MOSI (out), RFEN (out), SCLK (out), SDIO (bidir)

### Harnesses
MII: RST, COL, CRS, TXER, TXC, TXEN, TXD[3..0], RXER, RXC, RXDV, RXD[3..0], MDC, MDIO

### Nets
1V8: C6.2 C7.1 C118.2 C119.2 C120.2 C121.2 C122.2 C123.2 C124.2 C125.2 C126.2 C127.2 C128.2 C129.2 C130.2 C169.2 C170.2 C171.2 C172.2 C173.2 NP5.2 NP6.2 NP7.2 P2.6 R26.2 R27.2 R29.2 R30.2 R31.2 U11.G2(VCCO) U11.G13(VCCO) U11.K2(VCCO) U11.K13(VCCO) U11.N2(VCCO) U11.N6(VCCO) U11.N8(VCCO) U11.N13(VCCO) X2.1(STANDBY) X2.4(VDD)
GND: C6.1 C7.2 C118.1 C119.1 C120.1 C121.1 C122.1 C123.1 C124.1 C125.1 C126.1 C127.1 C128.1 C129.1 C130.1 C169.1 C170.1 C171.1 C172.1 C173.1 D4.2(K) D5.2(K) D6.2(K) D7.2(K) D8.2(K) NP4.2 P2.5 R24.2 R25.2 R28.2 SW1.2 U11.B8(VCCBATT) U11.G7(VREFN) U11.H8(VREFP) U11.N7(CFGBVS) X2.2(GND) X2.5(GND)
COL: U11.M2(L19N_VREF) ; port Ethernet.COL
CRS: U11.L2(L22P) ; port Ethernet.CRS
DB0: U11.N14(L21P_DQS)
DB1: U11.M14(L21N_DQS_D22)
DB2: U11.L14(L15N_DQS_DOUT_CSO_B)
DB3: U11.J13(L18P_D28)
DB4: U11.J14(L18N_D27)
DB5: U11.G14(L9P_DQS)
DB6: U11.F14(L9N_DQS_D13)
DB7: U11.F13(L10P_D14)
DB8: U11.E13(L10N_D15)
DB9: U11.D14(L11P_SRCC)
DB10: U11.C14(L11N_SRCC)
DB11: U11.C12(L6N_D08_VREF)
DB12: U11.B14(L5N_D07)
DB13: U11.B13(L5P_D06)
EN: CLK8.1 U11.M13(L15P_DQS_RDWR_B) ; port RFEN
ETHRST: U11.J1(L15N_DQS) ; port Ethernet.RST
MDC: U11.M1(L18P) ; port Ethernet.MDC
MDIO: U11.L1(L18N) ; port Ethernet.MDIO
RXC: U11.D1(L11P_SRCC) ; port Ethernet.RXC
RXD0: U11.E2(L10P)
RXD1: U11.F1(L9N_DQS)
RXD2: U11.F2(L8N)
RXD3: U11.G1(L9P_DQS)
RXDV: U11.D2(L10N) ; port Ethernet.RXDV
RXER: U11.C1(L11N_SRCC) ; port Ethernet.RXER
TCK: P2.4 U11.A7(TCK)
TDI: P2.2 U11.P7(TDI)
TDO: P2.3 U11.P6(TDO)
TMS: P2.1 U11.M6(TMS)
TXC: U11.G4(L12P_MRCC) ; port Ethernet.TXC
TXD0: U11.B2(L5P)
TXD1: U11.B1(L5N)
TXD2: U11.A2(L3N_DQS)
TXD3: U11.A3(L2N)
TXEN: U11.H2(L14P_SRCC) ; port Ethernet.TXEN
TXER: U11.N1(L20N) ; port Ethernet.TXER
NetCLK1_1: CLK1.1 U11.N11(L23N_D18) ; port SCLK
NetCLK2_1: CLK2.1 U11.P11(L24N_D16) ; port SDIO
NetCLK3_1: U11.P12(L22P_D21) ; port DACCS
NetCLK4_1: U11.P10(L24P_D17) ; port DACRST
NetCLK5_1: U11.N10(L23P_D19) ; port LD
NetCLK6_1: U11.P5(L24P) ; port LE
NetCLK7_1: U11.P4(L21P_DQS) ; port CE
NetCLK_1: U11.P13(L22N_D20) ; port DACCLK
NetD4_1: D4.1(A) R29.1 U11.P9(DONE)
NetD5_1: D5.1(A) R32.2
NetD6_1: D6.1(A) R33.2
NetD7_1: D7.1(A) R34.2
NetD8_1: D8.1(A) R35.2
NetNP4_1: NP4.1 R26.1 U11.M7(M0)
NetNP5_1: NP5.1 R24.1 U11.M9(M2)
NetNP6_1: NP6.1 R25.1 U11.M8(M1)
NetNP7_1: NP7.1 R28.1 U11.B10(L3P_DQS_PUDC_B)
NetR27_1: R27.1 U11.C11(L6P_FCS_B) ; port FCS_B
NetR30_1: R30.1 U11.P8(INIT_B)
NetR31_1: R31.1 SW1.4 U11.L7(PROGRAM_B)
NetR32_1: R32.1 U11.B6(IO_0)
NetR33_1: R33.1 U11.B5(L4P)
NetR34_1: R34.1 U11.A5(L4N)
NetR35_1: R35.1 U11.A4(L2P)
NetU2_2: U11.B12(L1N_D01_DIN) ; port MISO
NetU2_5: U11.B11(L1P_D00_MOSI) ; port MOSI
NetU2_6: U11.A8(CCLK) ; port CLK
NetU11_H11: U11.H11(L13P_MRCC) X2.3(OUTPUT)

Not connected (* = marked no-connect by the designer): SW1 1 3; U11 A10(L3N_DQS_EMCCLK) A12(L4P_D04) A13(L4N_D05) B3(L3P_DQS) C3(L1N) C4(L6N_VREF) C5(L6P) C10(L2N_D03) D3(L1P) D4(L7N) D10(L2P_D02) D12(L8P_D11) D13(L8N_D12) E4(L7P) E11(IO_0) E12(L7N_D10) F3(L8P) F4(L12N_MRCC) F11(L12N_MRCC) F12(L7P_D09) G8(VP) G11(L12P_MRCC) H1(L14N_SRCC) H3(L13N_MRCC) H4(L13P_MRCC) H7(VN) H12(L13N_MRCC) H13(L14P_SRCC) H14(L14N_SRCC) J2(L15P_DQS) J3(L17N) J4(L17P) J7(DXN) J8(DXP) J11(L17P_D30) J12(L17N_D29) K3(L16N) K4(L16P) K11(L19P_D26) K12(L19N_D25_VREF) L3(L22P) L5(IO_25) L12(L16P_CSI_B) L13(L16N_D31) M3(L19P) M4(L23N) M5(L23P) M10(IO_25) M11(L20P_D24) M12(L20N_D23) N4(L24N) P2(L20P) P3(L21N_DQS)

### Buses and harness runs
bus DB[13..0] = port DB[13..0]
bus RXD[3..0]
bus TXD[3..0]

### Notes on the sheet
- (in symbol XC7S25-1FTGB196C, part C) BANK 0; CONFIG; ADC; PROG; JTAG; POWER; MISC
- (in symbol XC7S25-1FTGB196C, part D) BANK 14; MEM 0; MEM 1; MEM 2; MEM 3; MISC
- (in symbol XC7S25-1FTGB196C, part E) BANK 14; MEM 0; MEM 1; MEM 2; MEM 3; MISC

### Library data of the parts
C6 C7 C118-C130 C169-C173 = Cap: Capacitor; Published: 8-Jun-2000; LatestRevisionDate: 17-Jul-2002; LatestRevisionNote: Re-released for DXP Platform.; PackageReference: RAD-0.3; Publisher: Altium Limited; PackageDescription: Radial Cap, Thru-Hole; 2 Leads; 0.3 in Pin Spacing
  C118: ComponentLink1Description: New link; ComponentLink1URL: *; Supplier 1: Digi-Key; Supplier Part Number 1: 490-9969-1-ND
  C119 C120 C129 C130 C172 C173: Supplier 1: Digi-Key; Supplier Part Number 1: 490-14466-1-ND
NP4-NP7 R24-R35 = Res1: Resistor; Published: 8-Jun-2000; LatestRevisionDate: 17-Jul-2002; LatestRevisionNote: Re-released for DXP Platform.; PackageReference: AXIAL-0.3; Publisher: Altium Limited; PackageDescription: Axial Device, Thru-Hole; 2 Leads; 0.3 in Pin Spacing
P2 = Header 6: Header, 6-Pin; LatestRevisionDate: 17-Jul-2002; LatestRevisionNote: Re-released for DXP Platform.; Publisher: Altium Limited
SW1 = PTS647SK38SMTR2LFS: No Description Available; Vendor: C&K; Built_By: EMA_Cory; SourceLibrary: C&K_2020-05-06; Datasheet: https://www.ckswitches.com/media/2567/pts647.pdf; Manufacturer_Part_Number: PTS647SK38SMTR2LFS; Copyright: Copyright (C) 2018 Accelerated Designs. All rights reserved; RefDes: RefDes; Type: DEV; Supplier 1: Digi-Key; Supplier Part Number 1: PTS647SK38SMTR2LFSCT-ND
D4-D8 = LED0: Published: 8-Jun-2000; LatestRevisionDate: 08-Jul-2005; LatestRevisionNote: Mech Layer 1 removed.; PackageReference: LED-0; Publisher: Altium Limited; PackageDescription: LED; 2 Leads
U11 = XC7S25-1FTGB196C: Supplier 1: Digi-Key

## Sheet Ethernet.SchDoc
size E
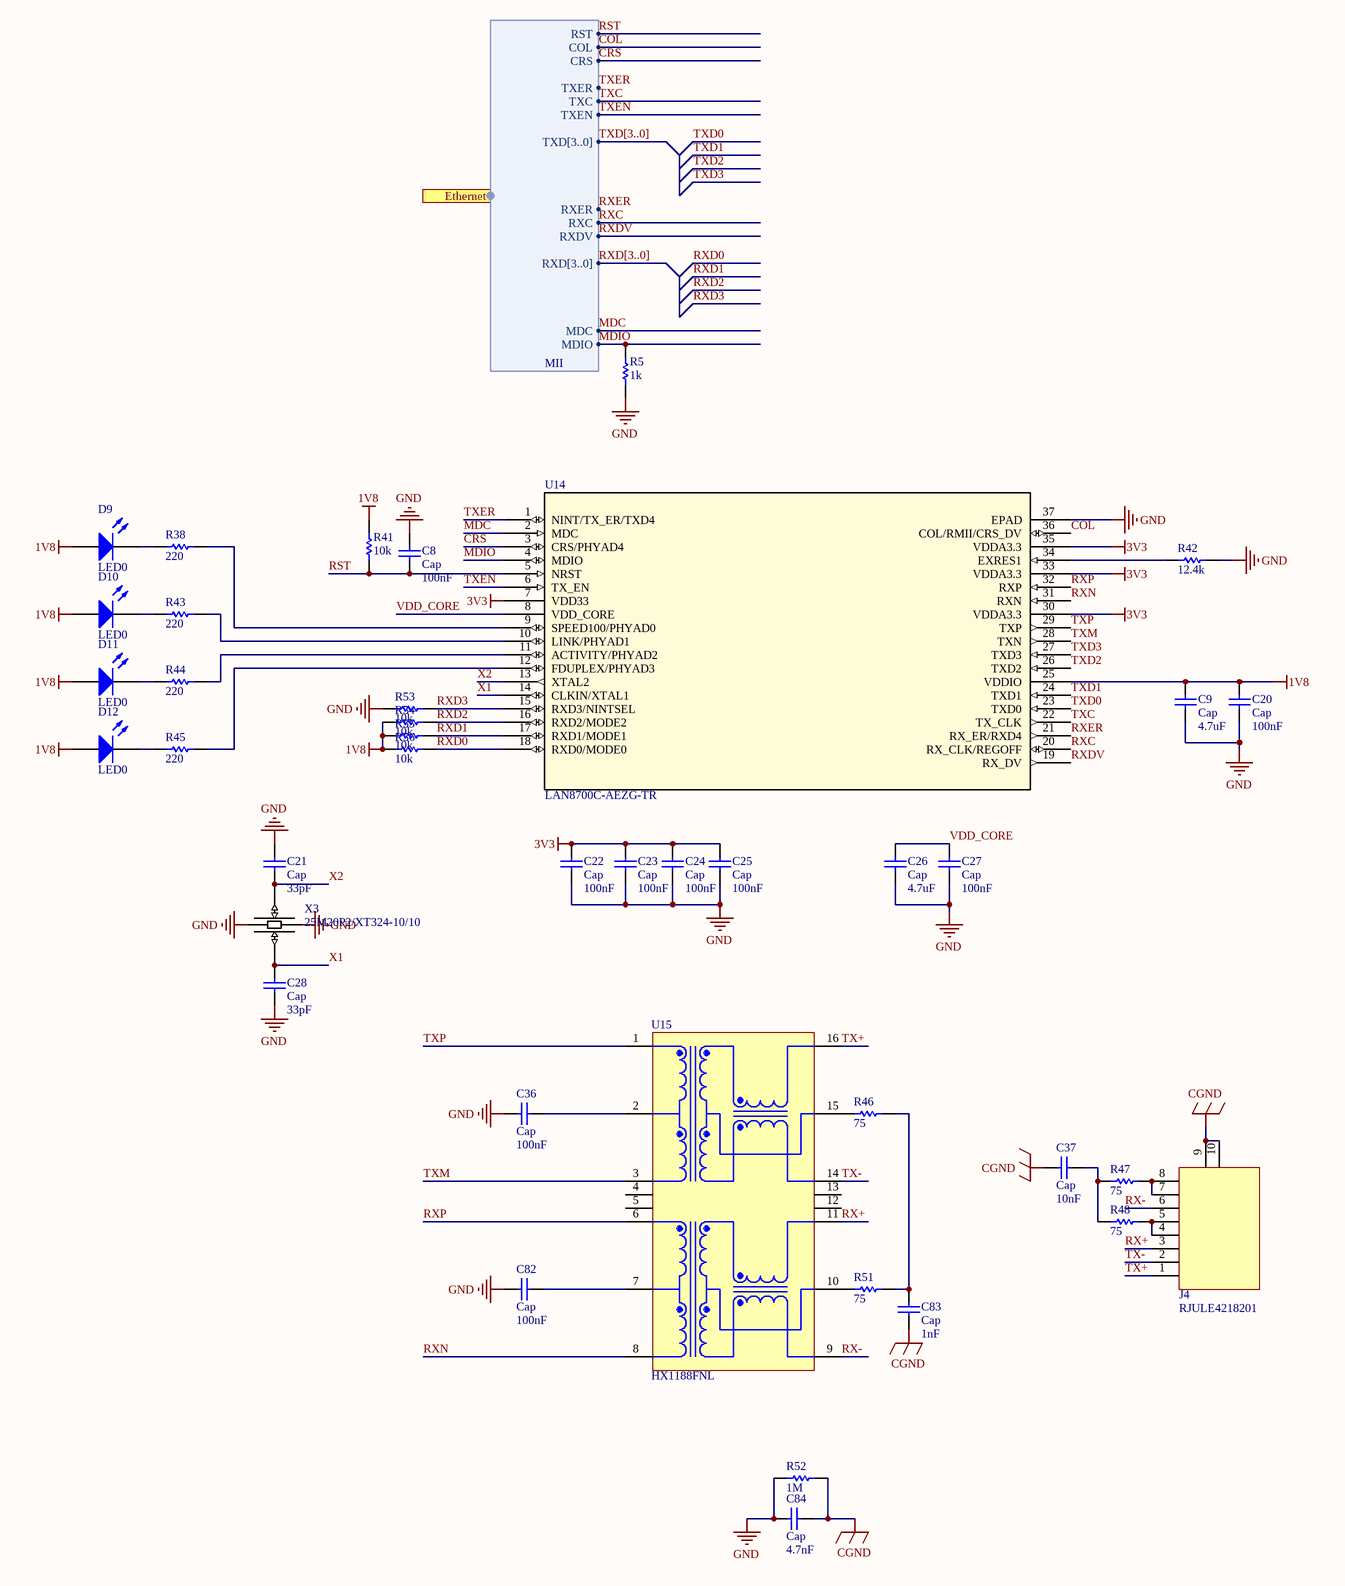
[diagram p7: Ethernet.SchDoc]

### Parts
(Parts that share a designator on the sheet are numbered #1, #2 ... from top to bottom, then left to right.)
C8  Cap  value 100nF  [0402-A]
C9  Cap  value 4.7uF  [1608[0603]]
C20#2  Cap  value 100nF  [6-0805_M]
C21#2  Cap  value 33pF  [0402-A]
C22#2  Cap  value 100nF  [0402-A]
C23#2  Cap  value 100nF  [0402-A]
C24#2  Cap  value 100nF  [0402-A]
C25#2  Cap  value 100nF  [0402-A]
C26#2  Cap  value 4.7uF  [1608[0603]]
C27#2  Cap  value 100nF  [0402-A]
C28#2  Cap  value 33pF  [0402-A]
C36  Cap  value 100nF  [1608[0603]]
C37  Cap  value 10nF  [0402-A]
C82  Cap  value 100nF  [1608[0603]]
C83  Cap  value 1nF  [0402-A]
C84  Cap  value 4.7nF  [C1206]
D9  LED0  [1608[0603]]
D10  LED0  [1608[0603]]
D11  LED0  [1608[0603]]
D12  LED0  [1608[0603]]
J4  RJULE4218201  [RJULE4218201]
R5  value 1k  [0402-A]  (hidden comment: Res1)
R38  value 220  [0402-A]  (hidden comment: Res1)
R41  value 10k  [0402-A]  (hidden comment: Res1)
R42  value 12.4k  [0402-A]  (hidden comment: Res1)
R43  value 220  [0402-A]  (hidden comment: Res1)
R44  value 220  [0402-A]  (hidden comment: Res1)
R45  value 220  [0402-A]  (hidden comment: Res1)
R46  value 75  [0402-A]  (hidden comment: Res1)
R47  value 75  [0402-A]  (hidden comment: Res1)
R48  value 75  [0402-A]  (hidden comment: Res1)
R51  value 75  [0402-A]  (hidden comment: Res1)
R52  value 1M  [C1206]  (hidden comment: Res1)
R53  value 10k  [0402-A]  (hidden comment: Res1)
R54  value 10k  [0402-A]  (hidden comment: Res1)
R55  value 10k  [0402-A]  (hidden comment: Res1)
R56  value 10k  [0402-A]  (hidden comment: Res1)
U14#2  LAN8700C-AEZG-TR  [QFN36_6X6MC_MCH]
U15  HX1188FNL  [PULS-HX1188FNL-SMT-16_V]
X3  25M20P2/XT324-10/10  [25M20P2/XT324-10/10]

### Ports
Ethernet (harness MII)

### Harnesses
MII: MDIO, MDC, RXD[3..0], TXD[3..0], RXDV, RXC, RXER, TXEN, TXC, TXER, CRS, COL, RST

### Nets
1V8: C9.1 C20#2.1 D9.1(A) D10.1(A) D11.1(A) D12.1(A) R41.1 R54.1 R55.1 R56.1 U14#2.25(VDDIO)
3V3: C22#2.1 C23#2.1 C24#2.1 C25#2.1 U14#2.7(VDD33) U14#2.30(VDDA3.3) U14#2.33(VDDA3.3) U14#2.35(VDDA3.3)
CGND: C37.2 C83.2 C84.2 J4.9 J4.10 R52.1
GND: C8.1 C9.2 C20#2.2 C21#2.2 C22#2.2 C23#2.2 C24#2.2 C25#2.2 C26#2.2 C27#2.2 C28#2.1 C36.2 C82.2 C84.1 R5.2 R42.1 R52.2 R53.1 U14#2.37(EPAD) X3.2 X3.4
COL: U14#2.36(COL/RMII/CRS_DV) ; port Ethernet.COL
CRS: U14#2.3(CRS/PHYAD4) ; port Ethernet.CRS
MDC: U14#2.2(MDC) ; port Ethernet.MDC
MDIO: R5.1 U14#2.4(MDIO) ; port Ethernet.MDIO
RST: C8.2 R41.2 U14#2.5(NRST) ; port Ethernet.RST  [project net ETHRST]
RX+: J4.3 U15.11(RX+)
RX-: J4.6 U15.9(RX-)
RXC: U14#2.20(RX_CLK/REGOFF) ; port Ethernet.RXC
RXD0: R56.2 U14#2.18(RXD0/MODE0)
RXD1: R55.2 U14#2.17(RXD1/MODE1)
RXD2: R54.2 U14#2.16(RXD2/MODE2)
RXD3: R53.2 U14#2.15(RXD3/NINTSEL)
RXDV: U14#2.19(RX_DV) ; port Ethernet.RXDV
RXER: U14#2.21(RX_ER/RXD4) ; port Ethernet.RXER
RXN: U14#2.31(RXN) U15.8(RD-)
RXP: U14#2.32(RXP) U15.6(RD+)
TX+: J4.1 U15.16(TX+)
TX-: J4.2 U15.14(TX-)
TXC: U14#2.22(TX_CLK) ; port Ethernet.TXC
TXD0: U14#2.23(TXD0)
TXD1: U14#2.24(TXD1)
TXD2: U14#2.26(TXD2)
TXD3: U14#2.27(TXD3)
TXEN: U14#2.6(TX_EN) ; port Ethernet.TXEN
TXER: U14#2.1(NINT/TX_ER/TXD4) ; port Ethernet.TXER
TXM: U14#2.28(TXN) U15.3(TD-)
TXP: U14#2.29(TXP) U15.1(TD+)
VDD_CORE: C26#2.1 C27#2.1 U14#2.8(VDD_CORE)
X1: C28#2.2 U14#2.14(CLKIN/XTAL1) X3.1
X2: C21#2.1 U14#2.13(XTAL2) X3.3
NetC36_1: C36.1 U15.2(TCT)
NetC37_1: C37.1 R47.2 R48.2
NetC82_1: C82.1 U15.7(RCT)
NetC83_1: C83.1 R46.1 R51.1
NetD9_2: D9.2(K) R38.1
NetD10_2: D10.2(K) R43.1
NetD11_2: D11.2(K) R44.1
NetD12_2: D12.2(K) R45.1
NetJ4_4: J4.4 J4.5 R48.1
NetJ4_7: J4.7 J4.8 R47.1
NetR38_2: R38.2 U14#2.9(SPEED100/PHYAD0)
NetR42_2: R42.2 U14#2.34(EXRES1)
NetR43_2: R43.2 U14#2.10(LINK/PHYAD1)
NetR44_2: R44.2 U14#2.11(ACTIVITY/PHYAD2)
NetR45_2: R45.2 U14#2.12(FDUPLEX/PHYAD3)
NetR46_2: R46.2 U15.15(CMT)
NetR51_2: R51.2 U15.10(CMT)

Not connected (* = marked no-connect by the designer): U15 4(NC) 5(NC) 12(NC) 13(NC)

### Buses and harness runs
bus RXD[3..0]
bus TXD[3..0]

### Library data of the parts
C8 C9 C20#2 C21#2 C22#2 C23#2 C24#2 C25#2 C26#2 C27#2 C28#2 C36 C37 C82-C84 = Cap: Capacitor; Published: 8-Jun-2000; LatestRevisionDate: 17-Jul-2002; LatestRevisionNote: Re-released for DXP Platform.; PackageReference: RAD-0.3; Publisher: Altium Limited; PackageDescription: Radial Cap, Thru-Hole; 2 Leads; 0.3 in Pin Spacing
  C8 C9 C20#2 C21#2 C22#2 C23#2 C24#2 C25#2 C26#2 C27#2 C28#2 C37 C82: Supplier 1: Digi-Key; Supplier Part Number 1: 490-3295-1-ND
R5 R38 R41-R48 R51-R56 = Res1: Resistor; Published: 8-Jun-2000; LatestRevisionDate: 17-Jul-2002; LatestRevisionNote: Re-released for DXP Platform.; PackageReference: AXIAL-0.3; Publisher: Altium Limited; PackageDescription: Axial Device, Thru-Hole; 2 Leads; 0.3 in Pin Spacing
U14#2 = LAN8700C-AEZG-TR: No Description Available; Mfr_Name: Microchip; Copyright: Copyright (C) 2021 Ultra Librarian. All rights reserved.; Manufacturer_Part_Number: LAN8700C-AEZG-TR; Digi-Key_Part_Number_1: LAN8700C-AEZG-CT-ND; Digi-Key_Part_Number_2: LAN8700C-AEZG-DKR-ND; Digi-Key_Part_Number_3: LAN8700C-AEZG-TR-ND; RefDes: RefDes; Type: DEV
U15 = CMP-2000-06431-1: Telecom Transformer 1:1/1:1, -40 to 85 degC, 16-Pin SMT, RoHS, Tube; Manufacturer: Pulse Electronics; Turns Ratio - Primary: Secondary:1:1Transmitter,1:1Receiver; Online Catalog: HX1188; Other Names: 553-2200; Other Related Documents: PackagesFNLvs.NL; Transformer Type: IsolationandDataInterface(Encapsulated); Datasheet Version: Rev. B, 05/2014; Family: PulseTransformers; PartNumber: HX1188FNL; Manufacturer URL: http://www.pulseelectronics.com/; Package Description: 16-Pin Surface Mount Device, Body 12.7 x 9.09 mm, Pitch 1.27 mm; Mounting Type: SurfaceMount; Package Reference: SMT; Mounting Technology: SurfaceMount; Datasheet URL: http://productfinder.pulseeng.com/products/datasheets/HX1188FNL.pdf;jsessionid=D0CB5525A348FF42F5E5BE320CB10324; Height - Seated (Max): 5.99mm; Category: Transformers; Standard Package: 40; Size / Dimension: 12.70mmLx9.00mmW
D9-D12 = LED0: Published: 8-Jun-2000; LatestRevisionDate: 08-Jul-2005; LatestRevisionNote: Mech Layer 1 removed.; PackageReference: LED-0; Publisher: Altium Limited; PackageDescription: LED; 2 Leads

## Sheet 1V0 Rail.SchDoc
size A
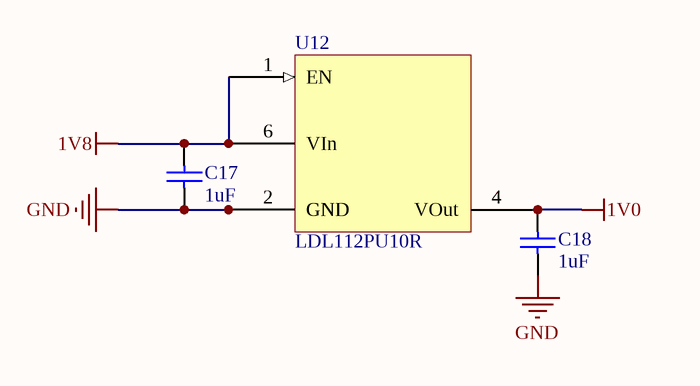
[diagram p8: 1V0 Rail.SchDoc]

### Parts
(Parts that share a designator on the sheet are numbered #1, #2 ... from top to bottom, then left to right.)
C17#2  value 1uF  [1608[0603]]  (hidden comment: Cap)
C18#2  value 1uF  [1608[0603]]  (hidden comment: Cap)
U12  LDL112PU10R  [LDL112PU10R]

### Nets
1V0: C18#2.1 U12.4(VOut)
1V8: C17#2.1 U12.1(EN) U12.6(VIn)
GND: C17#2.2 C18#2.2 U12.2(GND) U12.7(GND)

### Library data of the parts
C17#2 C18#2 = Cap: Capacitor; Published: 8-Jun-2000; LatestRevisionDate: 17-Jul-2002; LatestRevisionNote: Re-released for DXP Platform.; PackageReference: RAD-0.3; Publisher: Altium Limited; PackageDescription: Radial Cap, Thru-Hole; 2 Leads; 0.3 in Pin Spacing

## Sheet SPIflash.SchDoc
size A
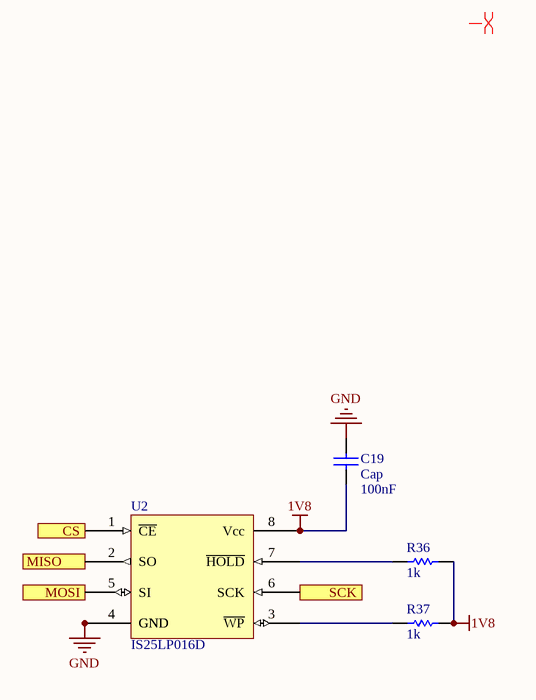
[diagram p9: SPIflash.SchDoc]

### Parts
(Parts that share a designator on the sheet are numbered #1, #2 ... from top to bottom, then left to right.)
C19#2  Cap  value 100nF  [0402-A]
R36  value 1k  [0402-A]  (hidden comment: Res1)
R37  value 1k  [0402-A]  (hidden comment: Res1)
U2  IS25LP016D  [IS25LP016D]

### Ports
CS (in), MISO (out), MOSI (in), SCK (in)

### Nets
1V8: C19#2.1 R36.1 R37.1 U2.8(Vcc)
GND: C19#2.2 U2.4(GND) U2.9(GND)
NetR27_1: U2.1(~{CE}) ; port CS
NetR36_2: R36.2 U2.7(~{HOLD})
NetR37_2: R37.2 U2.3(~{WP})
NetU2_2: U2.2(SO) ; port MISO
NetU2_5: U2.5(SI) ; port MOSI
NetU2_6: U2.6(SCK) ; port SCK

### Layout directives
differential pair: (no net found under the mark)

### Library data of the parts
C19#2 = Cap: Capacitor; Published: 8-Jun-2000; LatestRevisionDate: 17-Jul-2002; LatestRevisionNote: Re-released for DXP Platform.; PackageReference: RAD-0.3; Publisher: Altium Limited; PackageDescription: Radial Cap, Thru-Hole; 2 Leads; 0.3 in Pin Spacing
R36 R37 = Res1: Resistor; Published: 8-Jun-2000; LatestRevisionDate: 17-Jul-2002; LatestRevisionNote: Re-released for DXP Platform.; PackageReference: AXIAL-0.3; Publisher: Altium Limited; PackageDescription: Axial Device, Thru-Hole; 2 Leads; 0.3 in Pin Spacing

## Sheet CAN 3V3.SchDoc
size A
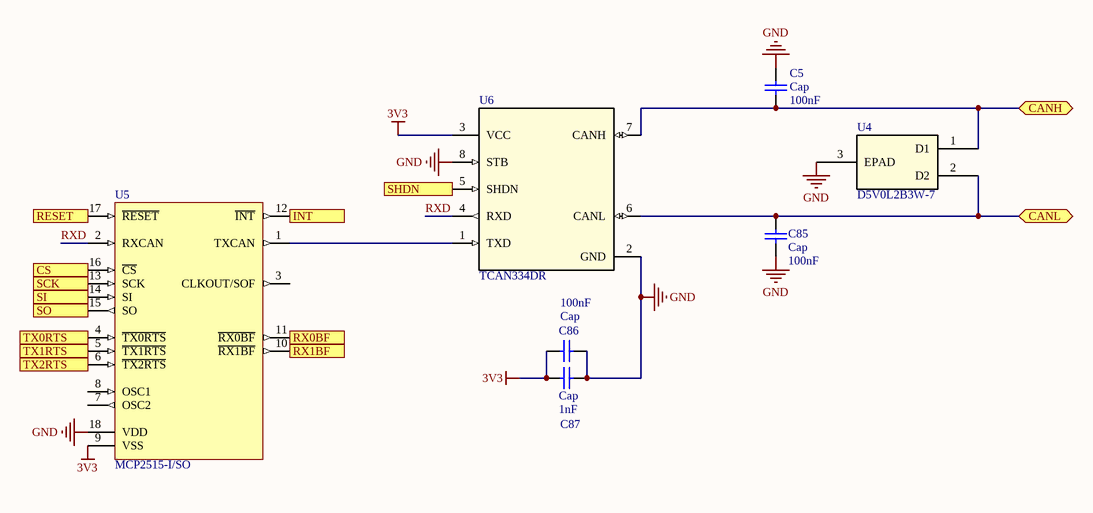
[diagram p10: CAN 3V3.SchDoc]

### Parts
C5  Cap  value 100nF  [1608[0603]]
C85  Cap  value 100nF  [1608[0603]]
C86  Cap  value 100nF  [1608[0603]]
C87  Cap  value 1nF  [1608[0603]]
U4  D5V0L2B3W-7  [SOT-323_DIO]
U5  MCP2515-I/SO  [SOIC-SO18_L]
U6  TCAN334DR  [D0008A_N]

### Ports
CANH (bidir), CANL (bidir), CS (in), INT (out), RESET (in), RX0BF (out), RX1BF (out), SCK (in), SHDN (in), SI (in), SO (out), TX0RTS (in), TX1RTS (in), TX2RTS (in)

### Nets
3V3: C86.1 C87.2 U5.9(VSS) U6.3(VCC)
GND: C5.1 C85.1 C86.2 C87.1 U4.3(EPAD) U5.18(VDD) U6.2(GND) U6.8(STB)
RXD: U5.2(RXCAN) U6.4(RXD)
NetC5_2: C5.2 U4.1(D1) U6.7(CANH) ; port CANH
NetC85_2: C85.2 U4.2(D2) U6.6(CANL) ; port CANL
NetU5_1: U5.1(TXCAN) U6.1(TXD)
NetU5_4: U5.4(~{TX0RTS}) ; port TX0RTS
NetU5_5: U5.5(~{TX1RTS}) ; port TX1RTS
NetU5_6: U5.6(~{TX2RTS}) ; port TX2RTS
NetU5_10: U5.10(~{RX1BF}) ; port RX1BF
NetU5_11: U5.11(~{RX0BF}) ; port RX0BF
NetU5_12: U5.12(~{INT}) ; port INT
NetU5_13: U5.13(SCK) ; port SCK
NetU5_14: U5.14(SI) ; port SI
NetU5_15: U5.15(SO) ; port SO
NetU5_16: U5.16(~{CS}) ; port CS
NetU5_17: U5.17(~{RESET}) ; port RESET
NetU6_5: U6.5(SHDN) ; port SHDN

Not connected (* = marked no-connect by the designer): U5 3(CLKOUT/SOF) 7(OSC2) 8(OSC1)

### Library data of the parts
C5 C85-C87 = Cap: Capacitor; Published: 8-Jun-2000; LatestRevisionDate: 17-Jul-2002; LatestRevisionNote: Re-released for DXP Platform.; PackageReference: RAD-0.3; Publisher: Altium Limited; PackageDescription: Radial Cap, Thru-Hole; 2 Leads; 0.3 in Pin Spacing
U4 = D5V0L2B3W-7: No Description Available; Vendor: Diodes Inc; Built_By: EMA_UL_Team; SourceLibrary: DIODESINC_2_2015-08-18; Manufacturer_Part_Number: D5V0L2B3W-7; Copyright: Copyright (C) 2018 Accelerated Designs. All rights reserved; RefDes: RefDes; Type: DEV
U5 = CMP-0186-00133-2: Stand-Alone CAN Controller With SPI Interface, 18-Pin SOIC, Industrial Temperature; ComponentLink2Description: Datasheet; RevisionNote: URLs added. DatasheetVersion updated.; PackageVersion: revBB, Aug-2009; ComponentLink1URL: http://www.microchip.com/; PackageReference: SOIC-SO18; PackageDescription: 18-Lead Plastic Small Outline (SO) - Wide 7.50mm Body [SOIC]; DatasheetVersion: revF, Oct-2010; ComponentLink2URL: http://ww1.microchip.com/downloads/en/DeviceDoc/21801f.pdf; ComponentLink3URL: http://www.microchip.com/stellent/groups/techpub_sg/documents/packagingspec/en012702.pdf; Code_JEDEC: MS-013; ComponentLink3Description: Package Specification; ComponentLink1Description: Manufacturer URL
U6 = TCAN334DR: No Description Available; Manufacturer: Texas Instruments; PartNumber: TCAN334DR; RefDes: RefDes; Type: DEV; Value: Value; Copyright: Copyright (C) 2018 Accelerated Designs. All rights reserved

## Sheet LSM6DSMTR.SchDoc
size A
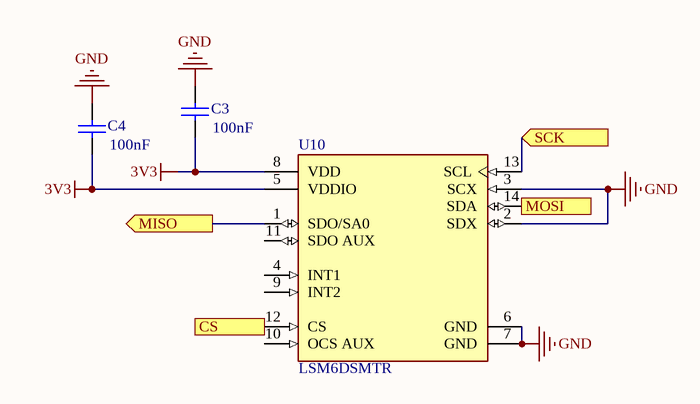
[diagram p11: LSM6DSMTR.SchDoc]

### Parts
C3  value 100nF  [1608[0603]]  (hidden comment: Cap)
C4  value 100nF  [1608[0603]]  (hidden comment: Cap)
U10  LSM6DSMTR  [FP-LGA-14L-DM00249496-MFG]

### Ports
CS (in), MISO (out), MOSI (in), SCK (in)

### Nets
3V3: C3.2 C4.2 U10.5(VDDIO) U10.8(VDD)
GND: C3.1 C4.1 U10.2(SDX) U10.3(SCX) U10.6(GND) U10.7(GND)
NetU5_13: U10.13(SCL) ; port SCK
NetU5_14: U10.14(SDA) ; port MOSI
NetU5_15: U10.1(SDO/SA0) ; port MISO
NetU9_5: U10.12(CS) ; port CS

Not connected (* = marked no-connect by the designer): U10 4(INT1) 9(INT2) 10(OCS_AUX) 11(SDO_AUX)

### Library data of the parts
C3 C4 = Cap: Capacitor; Published: 8-Jun-2000; LatestRevisionDate: 17-Jul-2002; LatestRevisionNote: Re-released for DXP Platform.; PackageReference: RAD-0.3; Publisher: Altium Limited; PackageDescription: Radial Cap, Thru-Hole; 2 Leads; 0.3 in Pin Spacing
U10 = CMP-12177-000008-1: IMU ACCEL/GYRO I2C/SPI 14LGA; Manufacturer: STMicroelectronics; Operating Supply Current: 0.29-0.65mA; Gyro Range: 125/250/500/1000/2000°/s; Sensor Output: I2C,SPI; Accel Range: 2/4/8/16g; Min Supply Voltage: 1.62V; Resolution: 16bits; Sensor Type: Temperature,Accelerometer,Gyroscope; Max Supply Voltage: 3.6V; Manufacturer Part Number: LSM6DSMTR; Octopart: https://octopart.com/lsm6dsmtr-stmicroelectronics-66358194; Height: 0.86mm; Category: IC; Lead Free: Yes; Temperature: -40°C to +85°C; Temperature Range Low: -40°C; ComponentLink2Description: Datasheet; ComponentLink2URL: https://www.st.com/resource/en/datasheet/lsm6dsm.pdf; Digikey Description: IMU ACCEL/GYRO I2C/SPI 14LGA; Footprint Url: https://www.st.com/content/ccc/resource/technical/document/technical_note/73/17/9c/16/dd/96/4a/01/CD00134799.pdf/files/CD00134799.pdf/jcr:content/translations/en.CD00134799.pdf; Device Class L1: Sensors; Device Class L2: Motion Sensors; Temperature Range High: +85°C; Mouser Description: LSM6DSM Series 3.6 V I2C/SPI 3D Accelerometer and 3D Gyroscope - LGA-14; Device Class L3: Inertial Measurement Units (IMUs); Automotive: No; Package: LGA-14L-DM00249496; RoHS: TRUE

## Sheet TMP235AQDB2TQ1.SchDoc
size A
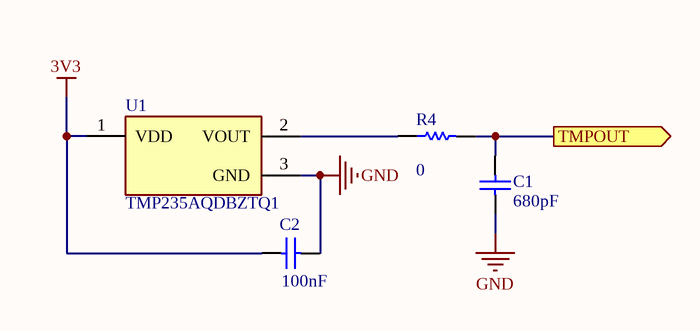
[diagram p12: TMP235AQDB2TQ1.SchDoc]

### Parts
C1  value 680pF  [1608[0603]]  (hidden comment: Cap)
C2  value 100nF  [1608[0603]]  (hidden comment: Cap)
R4  value 0  [0402-A]  (hidden comment: Res1)
U1  TMP235AQDBZTQ1  [FP-DBZ0003A-MFG]

### Ports
TMPOUT (out)

### Nets
3V3: C2.1 U1.1(VDD)
GND: C1.2 C2.2 U1.3(GND)
NetC1_1: C1.1 R4.2 ; port TMPOUT
NetR4_1: R4.1 U1.2(VOUT)

### Library data of the parts
C1 C2 = Cap: Capacitor; Published: 8-Jun-2000; LatestRevisionDate: 17-Jul-2002; LatestRevisionNote: Re-released for DXP Platform.; PackageReference: RAD-0.3; Publisher: Altium Limited; PackageDescription: Radial Cap, Thru-Hole; 2 Leads; 0.3 in Pin Spacing
R4 = Res1: Resistor; Published: 8-Jun-2000; LatestRevisionDate: 17-Jul-2002; LatestRevisionNote: Re-released for DXP Platform.; PackageReference: AXIAL-0.3; Publisher: Altium Limited; PackageDescription: Axial Device, Thru-Hole; 2 Leads; 0.3 in Pin Spacing
U1 = CMP-04948-000003-1: LOW-POWER HIGH-ACCURACY ANALOG O; Manufacturer: Texas Instruments; Manufacturer Part Number: TMP235A2DBZR; Output Current: 500uA; Operating Supply Current: 9uA; Max Supply Voltage: 5.5V; Max Junction Temp: +150°C; Accuracy: 0.5%; Min Supply Voltage: 2.3V; Standoff Height: 0.01mm; Sensor Output: Analog Voltage; Ambient Temperature Range Low: -40°C; Device Class L2: Temperature and Humidity Sensors; Digikey Description: LOW-POWER HIGH-ACCURACY ANALOG O; Lead Free: Yes; Category: IC; Device Class L3: unset; Temperature Range Low: -40°C; ComponentLink2Description: Datasheet; Package: DBZ0003A; Octopart: https://octopart.com/tmp235a2dbzr-texas+instruments-94966376; Device Class L1: Sensors; Temperature Range High: +150°C; Height: 1.12mm; Temperature: -40°C to +150°C; RoHS: TRUE; Ambient Temperature Range High: +150°C; Automotive: No; ComponentLink2URL: http://www.ti.com/lit/ds/symlink/tmp235.pdf; Mouser Description: ±2°C Analog output temperature sensor, with 10mV /°C gain 3-SOT-23 -40 to 150

## Sheet Modulator.SchDoc
size A
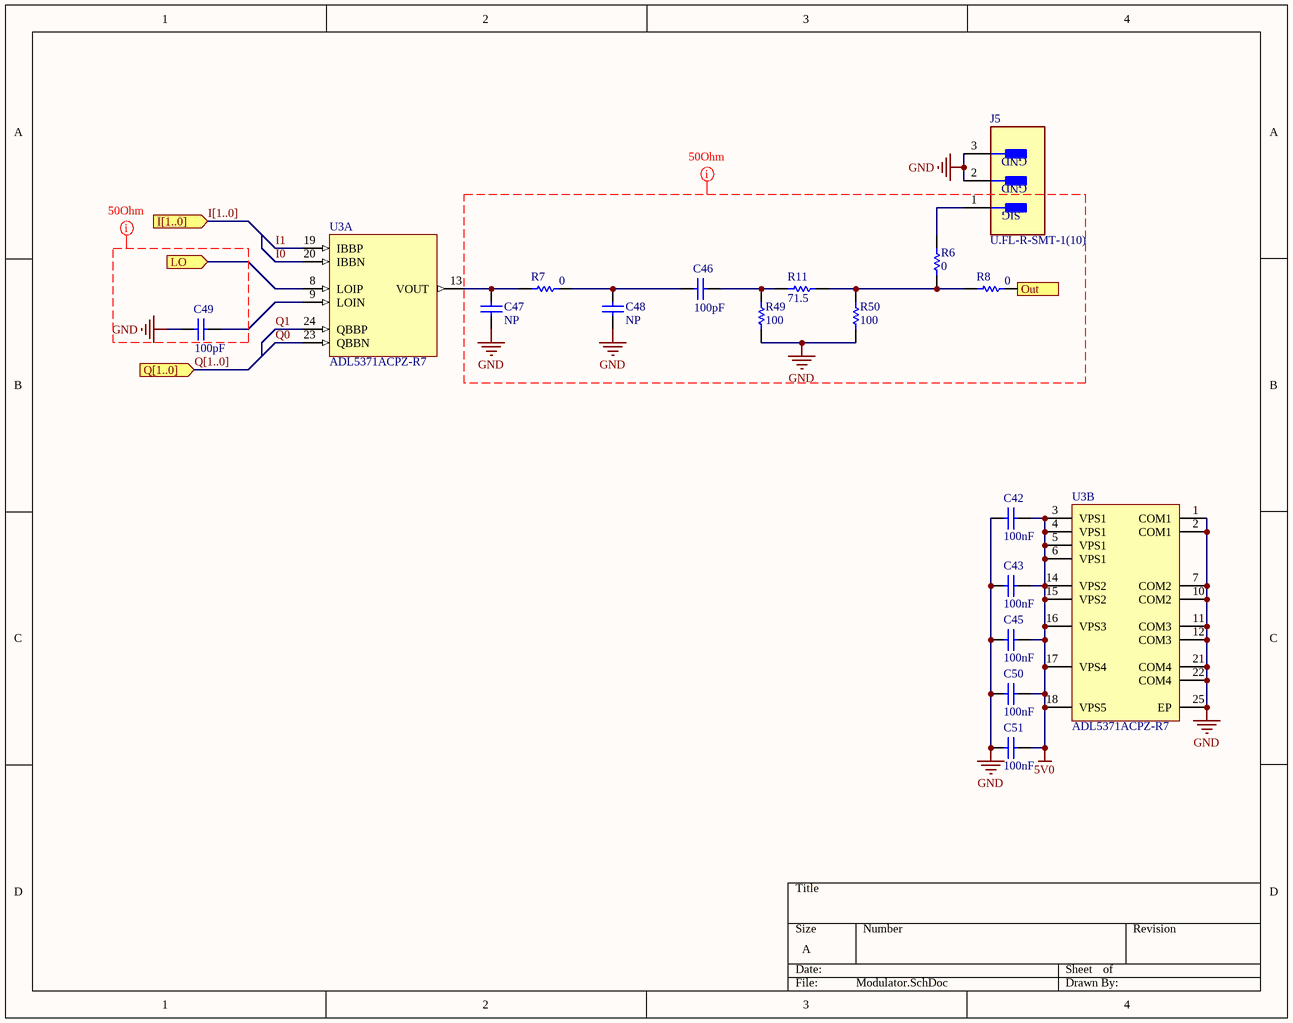
[diagram p13: Modulator.SchDoc]

### Parts
(Parts that share a designator on the sheet are numbered #1, #2 ... from top to bottom, then left to right.)
C42  value 100nF  [0402-A]  (hidden comment: Cap)
C43  value 100nF  [0402-A]  (hidden comment: Cap)
C45  value 100nF  [0402-A]  (hidden comment: Cap)
C46  value 100pF  [0402-A]  (hidden comment: Cap)
C47  value NP  [0402-A]  (hidden comment: Cap)
C48  value NP  [0402-A]  (hidden comment: Cap)
C49  value 100pF  [0402-A]  (hidden comment: Cap)
C50  value 100nF  [0402-A]  (hidden comment: Cap)
C51  value 100nF  [0402-A]  (hidden comment: Cap)
J5  U.FL-R-SMT-1(10)  [FP-U_FL-R-SMT-1_10-MFG]
R6  value 0  [0402-A]  (hidden comment: Res1)
R7  value 0  [0402-A]  (hidden comment: Res1)
R8  value 0  [0402-A]  (hidden comment: Res1)
R11#2  value 71.5  [0402-A]  (hidden comment: Res1)
R49  value 100  [0402-A]  (hidden comment: Res1)
R50  value 100  [0402-A]  (hidden comment: Res1)
U3  ADL5371ACPZ-R7  [ADI-CP-24-2_N]  (parts A,B of 2)

### Ports
I[1..0] (in), LO (in), Out (out), Q[1..0] (in)

### Nets
5V0: C42.2 C43.2 C45.2 C50.2 C51.2 U3.3(VPS1) U3.4(VPS1) U3.5(VPS1) U3.6(VPS1) U3.14(VPS2) U3.15(VPS2) U3.16(VPS3) U3.17(VPS4) U3.18(VPS5)
GND: C42.1 C43.1 C45.1 C47.2 C48.2 C49.2 C50.1 C51.1 J5.2(GND) J5.3(GND) R49.2 R50.2 U3.1(COM1) U3.2(COM1) U3.7(COM2) U3.10(COM2) U3.11(COM3) U3.12(COM3) U3.21(COM4) U3.22(COM4) U3.25(EP)
I0: U3.20(IBBN)
I1: U3.19(IBBP)
Q0: U3.23(QBBN)
Q1: U3.24(QBBP)
NetC18#1_1: R8.1 ; port Out
NetC46_1: C46.1 R11#2.1 R49.1
NetC46_2: C46.2 C48.1 R7.1
NetC47_1: C47.1 R7.2 U3.13(VOUT)
NetC49_1: C49.1 U3.9(LOIN)
NetJ5_1: J5.1(SIG) R6.1
NetR6_2: R6.2 R8.2 R11#2.2 R50.1
NetR75_2: U3.8(LOIP) ; port LO

### Buses and harness runs
bus I[1..0] = port I[1..0]
bus Q[1..0] = port Q[1..0]

### Layout directives
net class 50Ohm: GND

### Library data of the parts
C42 C43 C45-C51 = Cap: Capacitor; Published: 8-Jun-2000; LatestRevisionDate: 17-Jul-2002; LatestRevisionNote: Re-released for DXP Platform.; PackageReference: RAD-0.3; Publisher: Altium Limited; PackageDescription: Radial Cap, Thru-Hole; 2 Leads; 0.3 in Pin Spacing
J5 = CMP-2000-05152-2: CONN U.FL RCPT STR 50 OHM SMD; Body Plating: Silver; Impedance: 50R; Frequency: 6GHz; Connector Type: Coaxial; Dielectric Material: Polymer; Insulation Resistance: 500MR; Body Material: Bronze; Gender: Male; REACH SVHC: No SVHC; Depth: 3.1mm; Housing Color: Beige; Contact Material: Brass; Package Quantity: 2500; Max Frequency: 6GHz; Radiation Hardening: No; Packaging: Tape and Reel; Termination: Solder; Lead Free: Lead Free; Wire/Cable Type: Coaxial; Min Operating Temperature: -40°C; Max Operating Temperature: 90°C; Contact Plating: Gold; Mount: Surface Mount; Fastening Type: Snap; Orientation: Straight; Length: 3mm
R6-R8 R11#2 R49 R50 = Res1: Resistor; Published: 8-Jun-2000; LatestRevisionDate: 17-Jul-2002; LatestRevisionNote: Re-released for DXP Platform.; PackageReference: AXIAL-0.3; Publisher: Altium Limited; PackageDescription: Axial Device, Thru-Hole; 2 Leads; 0.3 in Pin Spacing
U3 = CMP-0285-00063-1: 500 MHz to 1500 MHz Quadrature Modulator, CP-24-2, Pb-Free, 1500 Reel; IIP3 (+dBm): 27dBm; Min RF Frequency (MHz): 700MHz; Output P1dB (dBm): 14.4; IQ Freq (MHz): 500MHz; Max RF Frequency (MHz): 1.3GHz; ComponentLink1URL: www.analog.com; PackageReference: CP-24-2; ComponentLink3Description: Package Specification; DatasheetVersion: Rev0; PackageVersion: Jan-2005; ComponentLink3URL: http://www.analog.com/static/imported-files/packages/588305704543880784658541CP_24_2.pdf; Code_JEDEC: MO-220-VGGD-2; ComponentLink1Description: Manufacturer URL; PackageDescription: 24-Lead Lead Frame Chip Scale Package [LFCSP_VQ]; ComponentLink2URL: http://www.analog.com/static/imported-files/data_sheets/ADL5371.pdf; ComponentLink2Description: Datasheet